# EasyEDA Pro project Thunder F722 Drone Flight Controller_2024-11-16.epro

# Schematic Thunder F722 PCBA Low Cost
Board Name: Board1; Create Date: 2024-11-16; Page Name: SCH_GIT_FULL; Project Name: ⚡ Thunder F722 Drone Flight Controller ⚡; Schematic Name: Thunder F722 PCBA Low Cost; Update Date: 2024-11-16; Add into BOM: yes; Company: TROPICAL FPV; Convert to PCB: yes; Date: 2024-11-15; Draw By: ALESSANDRO; REV: 1.2; Sheet: 1/1
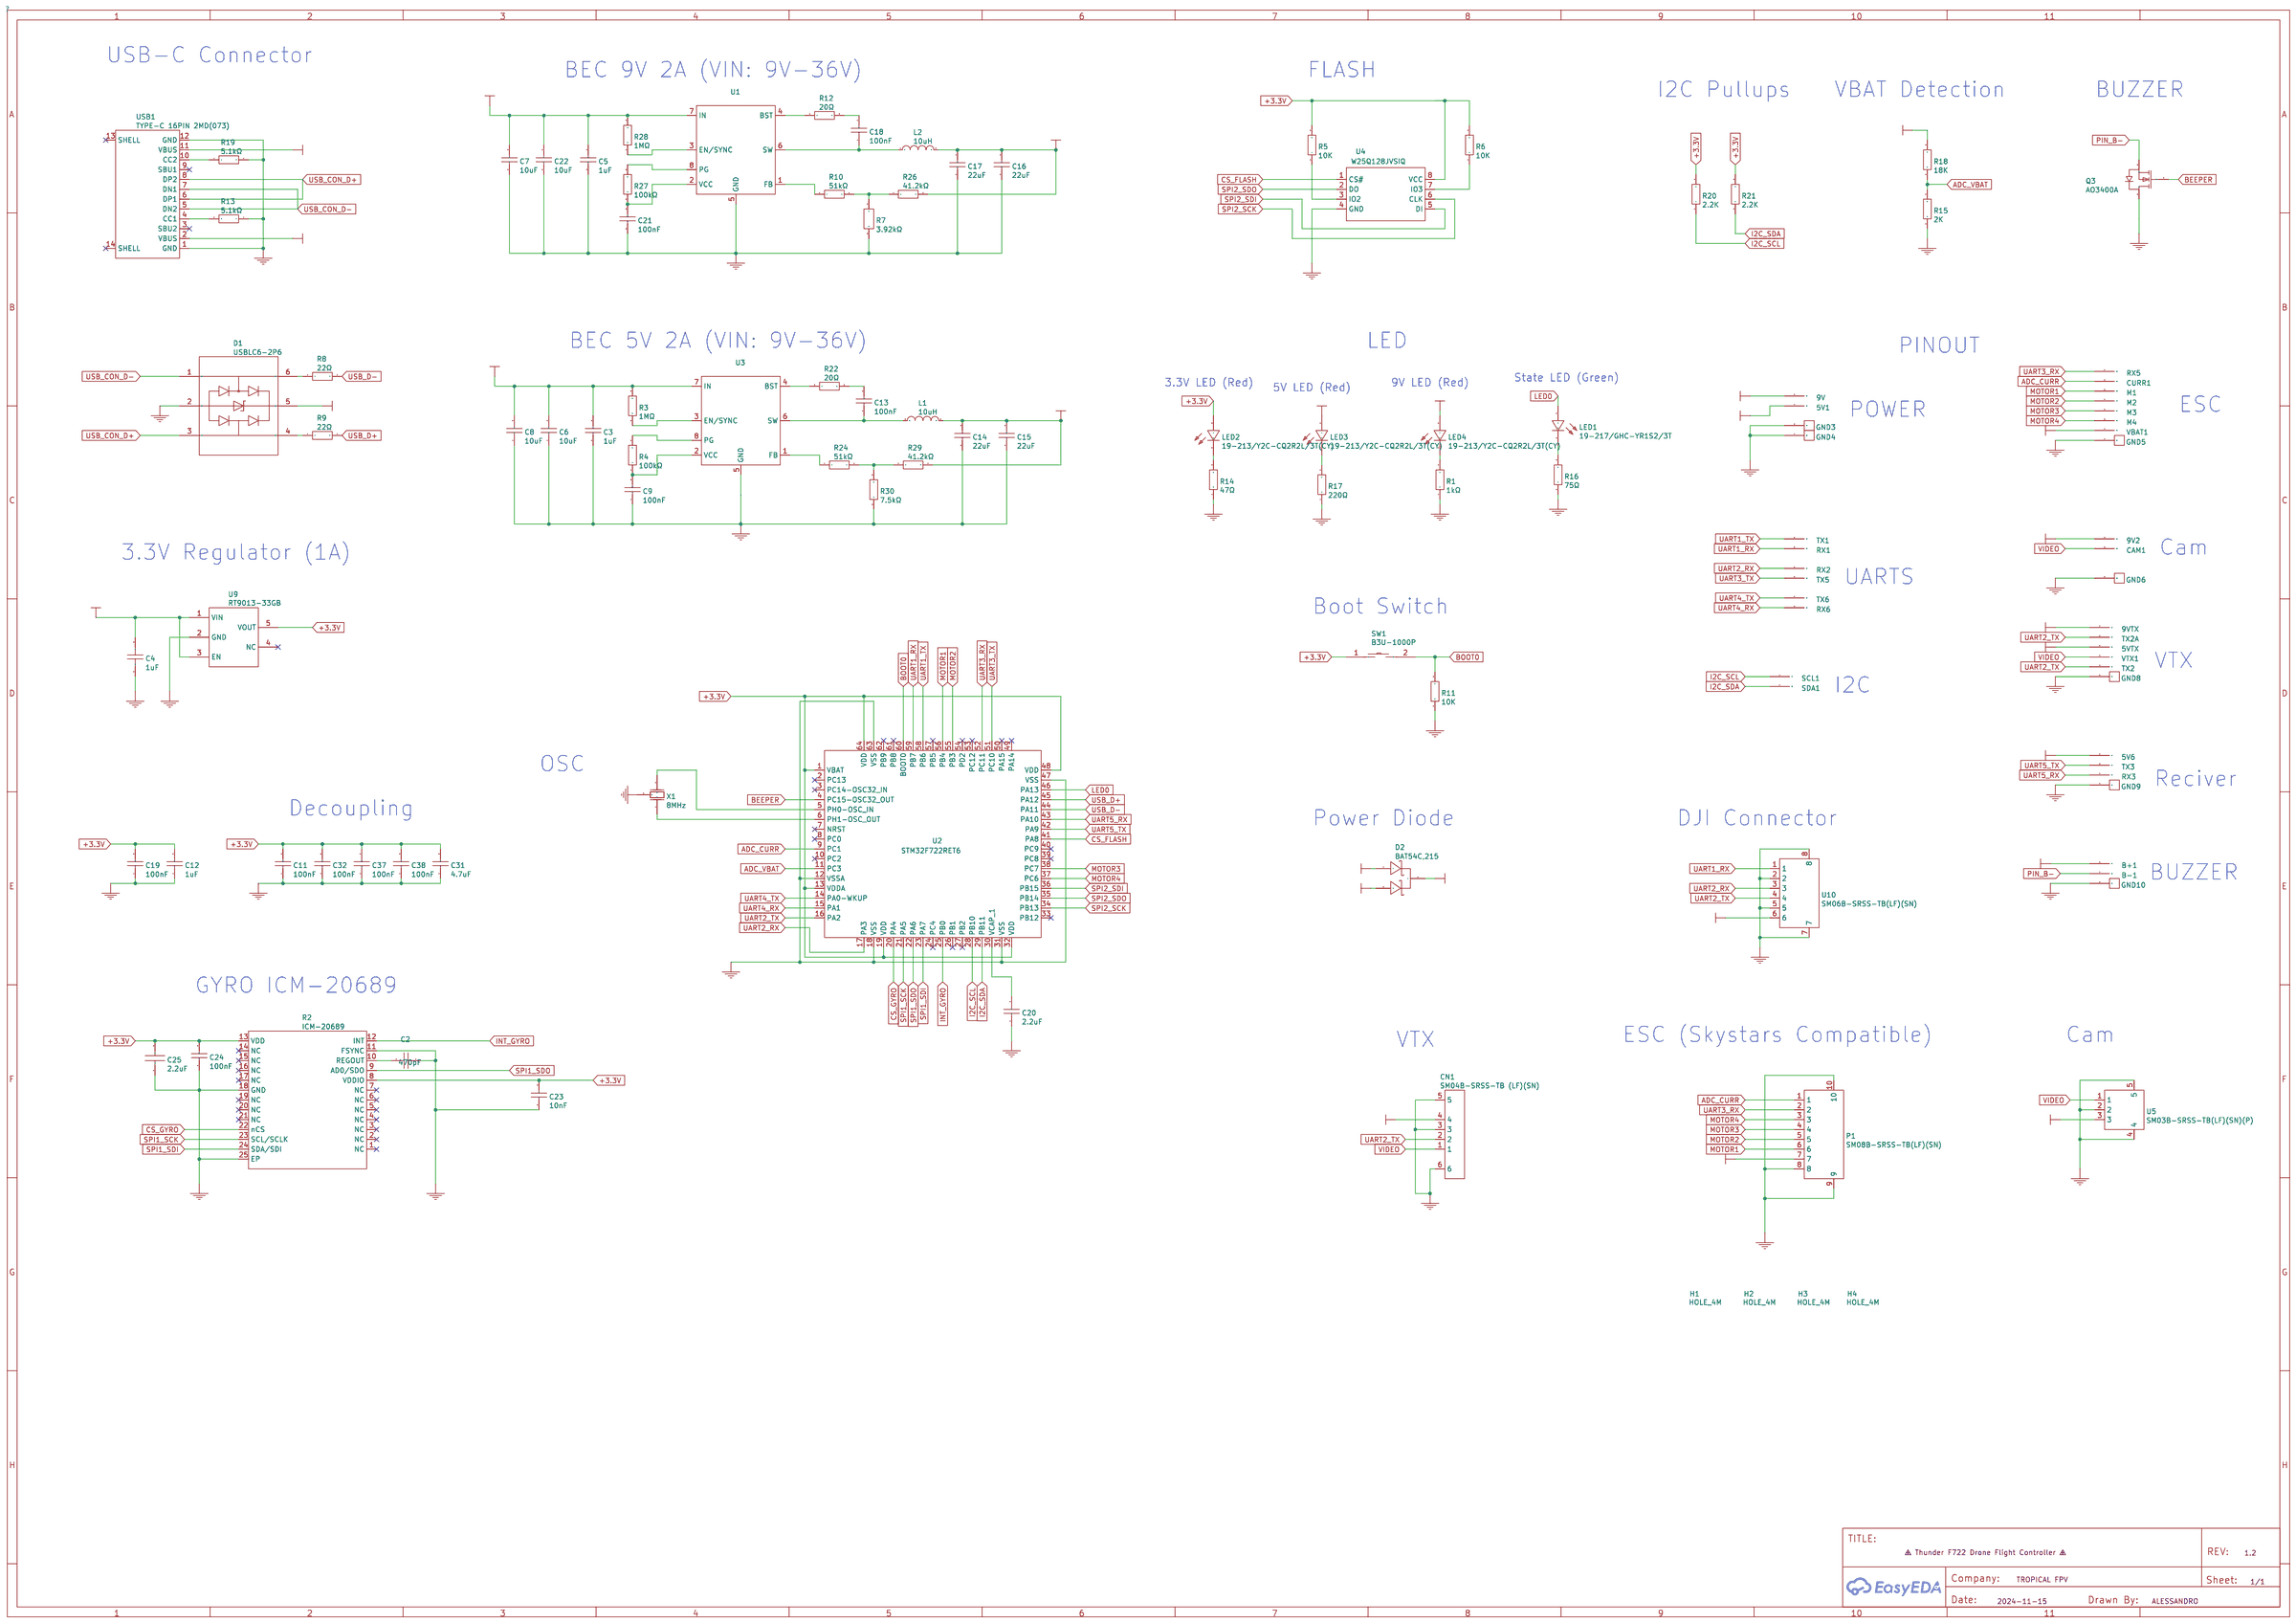
[diagram p0: schematic sheet]

## Parts
5V1  ROUND SOLDER PADS WITH HOLE 1.5MM X 2.5MM COPY  [ROUND SOLDER PADS WITH HOLE 1MM X 1.75MM]  (no BOM)
5V6  ROUND SOLDER PADS WITH HOLE 1.5MM X 2.5MM COPY  [ROUND SOLDER PADS WITH HOLE 1MM X 1.75MM]  (no BOM)
5VTX  ROUND SOLDER PADS WITH HOLE 1.5MM X 2.5MM COPY  [ROUND SOLDER PADS WITH HOLE 1MM X 1.75MM]  (no BOM)
9V  ROUND SOLDER PADS WITH HOLE 1.5MM X 2.5MM COPY  [ROUND SOLDER PADS WITH HOLE 1MM X 1.75MM]  (no BOM)
9V2  ROUND SOLDER PADS WITH HOLE 1.5MM X 2.5MM COPY  [ROUND SOLDER PADS WITH HOLE 1MM X 1.75MM]  (no BOM)
9VTX  ROUND SOLDER PADS WITH HOLE 1.5MM X 2.5MM COPY  [ROUND SOLDER PADS WITH HOLE 1MM X 1.75MM]  (no BOM)
B+1  ROUND SOLDER PADS WITH HOLE 1.5MM X 2.5MM COPY  [ROUND SOLDER PADS WITH HOLE 1MM X 1.75MM]  (no BOM)
B-1  ROUND SOLDER PADS WITH HOLE 1.5MM X 2.5MM COPY  [ROUND SOLDER PADS WITH HOLE 1MM X 1.75MM]  (no BOM)
C2  470pF  [C0402]
C3  1uF  [C0603]
C4  1uF  [C0402]
C5  1uF  [C0603]
C6  10uF  [C1206]
C7  10uF  [C1206]
C8  10uF  [C1206]
C9  100nF  [C0402]
C11  100nF  [C0402]
C12  1uF  [C0603]
C13  100nF  [C0402]
C14  22uF  [C1206]
C15  22uF  [C1206]
C16  22uF  [C1206]
C17  22uF  [C1206]
C18  100nF  [C0402]
C19  100nF  [C0402]
C20  2.2uF  [C0603]
C21  100nF  [C0402]
C22  10uF  [C1206]
C23  10nF  [C0402]
C24  100nF  [C0402]
C25  2.2uF  [C0402]
C31  4.7uF  [C0603]
C32  100nF  [C0402]
C37  100nF  [C0402]
C38  100nF  [C0402]
CAM1  ROUND SOLDER PADS WITH HOLE 1.5MM X 2.5MM COPY  [ROUND SOLDER PADS WITH HOLE 1MM X 1.75MM]  (no BOM)
CN1  SM04B-SRSS-TB (LF)(SN)  [CONN-SMD_4P-P1.00_SM04B-SRSS-TB-LF-SN]
CURR1  ROUND SOLDER PADS WITH HOLE 1.5MM X 2.5MM COPY  [ROUND SOLDER PADS WITH HOLE 1MM X 1.75MM]  (no BOM)
D1  USBLC6-2P6  [SOT-666-6_L1.6-W1.2-P0.50-LS1.6-BR]
D2  BAT54C,215  [SOT-23-3_L2.9-W1.6-P1.90-LS2.8-BR]
GND3  RECTANGLE SOLDER PADS WITH HOLE 1.5MM X 2.5MM  [RECTANGLE SOLDER PADS WITH HOLE 1.25MM X 1.75MM]  (no BOM)
GND4  RECTANGLE SOLDER PADS WITH HOLE 1.5MM X 2.5MM  [RECTANGLE SOLDER PADS WITH HOLE 1.25MM X 1.75MM]  (no BOM)
GND5  RECTANGLE SOLDER PADS WITH HOLE 1.5MM X 2.5MM  [RECTANGLE SOLDER PADS WITH HOLE 1.25MM X 1.75MM]  (no BOM)
GND6  RECTANGLE SOLDER PADS WITH HOLE 1.5MM X 2.5MM  [RECTANGLE SOLDER PADS WITH HOLE 1.25MM X 1.75MM]  (no BOM)
GND8  RECTANGLE SOLDER PADS WITH HOLE 1.5MM X 2.5MM  [RECTANGLE SOLDER PADS WITH HOLE 1.25MM X 1.75MM]  (no BOM)
GND9  RECTANGLE SOLDER PADS WITH HOLE 1.5MM X 2.5MM  [RECTANGLE SOLDER PADS WITH HOLE 1.25MM X 1.75MM]  (no BOM)
GND10  RECTANGLE SOLDER PADS WITH HOLE 1.5MM X 2.5MM  [RECTANGLE SOLDER PADS WITH HOLE 1.25MM X 1.75MM]  (no BOM)
H1  HOLE_4M  [HOLE_4MM]  (no BOM)
H2  HOLE_4M  [HOLE_4MM]  (no BOM)
H3  HOLE_4M  [HOLE_4MM]  (no BOM)
H4  HOLE_4M  [HOLE_4MM]  (no BOM)
L1  10uH  [IND-SMD_L4.4-W4.2_PSPMAA0412]
L2  10uH  [IND-SMD_L4.4-W4.2_PSPMAA0412]
LED1  19-217/GHC-YR1S2/3T  [LED0603-R-RD]
LED2  19-213/Y2C-CQ2R2L/3T(CY)  [LED0603-RD-YELLOW]
LED3  19-213/Y2C-CQ2R2L/3T(CY)  [LED0603-RD-YELLOW]
LED4  19-213/Y2C-CQ2R2L/3T(CY)  [LED0603-RD-YELLOW]
M1  ROUND SOLDER PADS WITH HOLE 1.5MM X 2.5MM COPY  [ROUND SOLDER PADS WITH HOLE 1MM X 1.75MM]  (no BOM)
M2  ROUND SOLDER PADS WITH HOLE 1.5MM X 2.5MM COPY  [ROUND SOLDER PADS WITH HOLE 1MM X 1.75MM]  (no BOM)
M3  ROUND SOLDER PADS WITH HOLE 1.5MM X 2.5MM COPY  [ROUND SOLDER PADS WITH HOLE 1MM X 1.75MM]  (no BOM)
M4  ROUND SOLDER PADS WITH HOLE 1.5MM X 2.5MM COPY  [ROUND SOLDER PADS WITH HOLE 1MM X 1.75MM]  (no BOM)
P1  SM08B-SRSS-TB(LF)(SN)  [CONN-TH_SM08B-SRSS-TB-LF-SN]
Q3  AO3400A  [SOT-23-3_L2.9-W1.6-P1.90-LS2.8-BR]
R1  1kΩ  [R0603]
R2  ICM-20689  [QFN-24_L4.0-W4.0-P0.50-TL-EP2.6]
R3  1MΩ  [R0603]
R4  100kΩ  [R0402]
R5  10K  [R0402]
R6  10K  [R0402]
R7  3.92kΩ  [R1206]
R8  22Ω  [R0402]
R9  22Ω  [R0402]
R10  51kΩ  [R0402]
R11  10K  [R0402]
R12  20Ω  [R0603]
R13  5.1kΩ  [R0402]
R14  47Ω  [R0402]
R15  2K  [R0402]
R16  75Ω  [R0603]
R17  220Ω  [R0402]
R18  18K  [R0402]
R19  5.1kΩ  [R0402]
R20  2.2K  [R0402]
R21  2.2K  [R0402]
R22  20Ω  [R0603]
R24  51kΩ  [R0402]
R26  41.2kΩ  [R1206]
R27  100kΩ  [R0402]
R28  1MΩ  [R0603]
R29  41.2kΩ  [R1206]
R30  7.5kΩ  [R0402]
RX1  ROUND SOLDER PADS WITH HOLE 1.5MM X 2.5MM COPY  [ROUND SOLDER PADS WITH HOLE 1MM X 1.75MM]  (no BOM)
RX2  ROUND SOLDER PADS WITH HOLE 1.5MM X 2.5MM COPY  [ROUND SOLDER PADS WITH HOLE 1MM X 1.75MM]  (no BOM)
RX3  ROUND SOLDER PADS WITH HOLE 1.5MM X 2.5MM COPY  [ROUND SOLDER PADS WITH HOLE 1MM X 1.75MM]  (no BOM)
RX5  ROUND SOLDER PADS WITH HOLE 1.5MM X 2.5MM COPY  [ROUND SOLDER PADS WITH HOLE 1MM X 1.75MM]  (no BOM)
RX6  ROUND SOLDER PADS WITH HOLE 1.5MM X 2.5MM COPY  [ROUND SOLDER PADS WITH HOLE 1MM X 1.75MM]  (no BOM)
SCL1  ROUND SOLDER PADS WITH HOLE 1.5MM X 2.5MM COPY  [ROUND SOLDER PADS WITH HOLE 1MM X 1.75MM]  (no BOM)
SDA1  ROUND SOLDER PADS WITH HOLE 1.5MM X 2.5MM COPY  [ROUND SOLDER PADS WITH HOLE 1MM X 1.75MM]  (no BOM)
SW1  B3U-1000P  [KEY-SMD_B3U-1000PM]
TX1  ROUND SOLDER PADS WITH HOLE 1.5MM X 2.5MM COPY  [ROUND SOLDER PADS WITH HOLE 1MM X 1.75MM]  (no BOM)
TX2  ROUND SOLDER PADS WITH HOLE 1.5MM X 2.5MM COPY  [ROUND SOLDER PADS WITH HOLE 1MM X 1.75MM]  (no BOM)
TX2A  ROUND SOLDER PADS WITH HOLE 1.5MM X 2.5MM COPY  [ROUND SOLDER PADS WITH HOLE 1MM X 1.75MM]  (no BOM)
TX3  ROUND SOLDER PADS WITH HOLE 1.5MM X 2.5MM COPY  [ROUND SOLDER PADS WITH HOLE 1MM X 1.75MM]  (no BOM)
TX5  ROUND SOLDER PADS WITH HOLE 1.5MM X 2.5MM COPY  [ROUND SOLDER PADS WITH HOLE 1MM X 1.75MM]  (no BOM)
TX6  ROUND SOLDER PADS WITH HOLE 1.5MM X 2.5MM COPY  [ROUND SOLDER PADS WITH HOLE 1MM X 1.75MM]  (no BOM)
U1  NO  [QFN-8_L3.0-W3.0-P0.65-BL]
U2  STM32F722RET6  [LQFP-64_L10.0-W10.0-P0.50-LS12.0-BL]
U3  NO  [QFN-8_L3.0-W3.0-P0.65-BL]
U4  W25Q128JVSIQ  [SOIC-8_L5.3-W5.3-P1.27-LS8.0-BL]
U5  SM03B-SRSS-TB(LF)(SN)(P)  [CONN-SMD_SM03B-SRSS-TB-LF-SN-P]
U9  RT9013-33GB  [SOT-23-5_L3.0-W1.7-P0.95-LS2.8-BR]
U10  SM06B-SRSS-TB(LF)(SN)  [CONN-SMD_SM06B-SRSS-TB(LF)(SN)]
USB1  TYPE-C 16PIN 2MD(073)  [USB-C-SMD_TYPE-C-6PIN-2MD-073]
VBAT1  ROUND SOLDER PADS WITH HOLE 1.5MM X 2.5MM COPY  [ROUND SOLDER PADS WITH HOLE 1MM X 1.75MM]  (no BOM)
VTX1  ROUND SOLDER PADS WITH HOLE 1.5MM X 2.5MM COPY  [ROUND SOLDER PADS WITH HOLE 1MM X 1.75MM]  (no BOM)
X1  8MHz  [OSC-SMD_3P-L3.2-W1.3-P1.20-L]

## Library data of the parts
5V1 5V6 5VTX 9V 9V2 9VTX B+1 B-1 CAM1 CURR1 M1-M4 RX1-RX3 RX5 RX6 SCL1 SDA1 TX1 TX2 TX2A TX3 TX5 TX6 VBAT1 VTX1 = ROUND SOLDER PADS WITH HOLE 1.5MM X 2.5MM COPY: Manufacturer Part: solderpad
C2 = 470pF: Supplier: LCSC; Manufacturer: FH(风华); Manufacturer Part: 0402B471K500NT; Supplier Part: C1537; JLCPCB Part Class: Basic Part; link: https://lcsc.com/eda_search?q=C1537&amp;%26type=1&amp;ref=editor
C3 C5 C12 = 1uF: Supplier: LCSC; Manufacturer Part: CL10A105KB8NNNC; Manufacturer: SAMSUNG; Supplier Part: C15849; JLCPCB Part Class: Basic
C4 = 1uF: Supplier: LCSC; Manufacturer: SAMSUNG; Manufacturer Part: CL05A105KA5NQNC; Supplier Part: C52923; JLCPCB Part Class: Basic
C6-C8 C22 = 10uF: Supplier: LCSC; Manufacturer Part: CL31A106KBHNNNE; Manufacturer: SAMSUNG; Supplier Part: C13585; JLCPCB Part Class: Basic
C9 C11 C13 C18 C19 C21 C24 C32 C37 C38 = 100nF: Supplier: LCSC; Manufacturer Part: CL05B104KO5NNNC; Manufacturer: SAMSUNG; Supplier Part: C1525; JLCPCB Part Class: Basic
C14-C17 = 22uF: Supplier: LCSC; Manufacturer Part: CL31A226KPHNNNE; Manufacturer: SAMSUNG(三星); Supplier Part: C5672; JLCPCB Part Class: Basic Part; link: https://lcsc.com/eda_search?q=C5672&amp;%26type=1&amp;ref=editor
C20 = 2.2uF: Supplier: LCSC; Manufacturer Part: CL10A225KO8NNNC; Manufacturer: SAMSUNG; Supplier Part: C23630; JLCPCB Part Class: Basic
C23 = 10nF: Supplier: LCSC; Manufacturer Part: CL05B103KB5NNNC; Manufacturer: SAMSUNG(三星); Supplier Part: C15195; JLCPCB Part Class: Basic Part; link: https://lcsc.com/eda_search?q=C15195&amp;%26type=1&amp;ref=editor
C25 = 2.2uF: Supplier: LCSC; Manufacturer Part: CL05A225MQ5NSNC; Manufacturer: SAMSUNG(三星); Supplier Part: C12530; JLCPCB Part Class: Basic Part; link: https://lcsc.com/eda_search?q=C12530&amp;%26type=1&amp;ref=editor
C31 = 4.7uF: Supplier: LCSC; Manufacturer Part: CL10A475KO8NNNC; Manufacturer: SAMSUNG; Supplier Part: C19666; JLCPCB Part Class: Basic
CN1 = SM04B-SRSS-TB (LF)(SN): Supplier: LCSC; Supplier Part: C160404; Manufacturer: JST; Manufacturer Part: SM04B-SRSS-TB(LF)(SN); JLCPCB Part Class: Extended Part; link: https://lcsc.com/eda_search?q=C160404&amp;%26type=1&amp;ref=editor
D1 = USBLC6-2P6: Supplier: LCSC; Manufacturer: STMicroelectronics; image: //image.lceda.cn/szlcsc/C15999.jpg; Supplier Part: C15999; JLCPCB Part Class: Extend
D2 = BAT54C,215: Supplier: LCSC; Manufacturer: Nexperia(安世); Supplier Part: C37704; JLCPCB Part Class: Basic Part; link: https://lcsc.com/eda_search?q=C37704&amp;%26type=1&amp;ref=editor
GND3-GND6 GND8-GND10 = RECTANGLE SOLDER PADS WITH HOLE 1.5MM X 2.5MM: Manufacturer Part: solderpad
H1-H4 = HOLE_4M
L1 L2 = 10uH: Supplier: LCSC; Supplier Part: C351093; Manufacturer: YJYCOIN(益嘉源); Manufacturer Part: YSPI0420-100M; JLCPCB Part Class: Extended Part; link: https://lcsc.com/eda_search?q=C351093&amp;%26type=1&amp;ref=editor
LED1 = 19-217/GHC-YR1S2/3T: Supplier: LCSC; Manufacturer: EVERLIGHT; image: //image.lceda.cn/szlcsc/C72043.jpg; Supplier Part: C72043; JLCPCB Part Class: Basic
LED2-LED4 = 19-213/Y2C-CQ2R2L/3T(CY): Supplier: LCSC; Manufacturer: EVERLIGHT(亿光); Supplier Part: C72038; JLCPCB Part Class: Basic Part
P1 = SM08B-SRSS-TB(LF)(SN): Supplier: LCSC; Supplier Part: C160407; Manufacturer: JST; JLCPCB Part Class: Extended Part; link: https://lcsc.com/eda_search?q=C160407&amp;%26type=1&amp;ref=editor
Q3 = AO3400A: Supplier: LCSC; Manufacturer: AOS; image: //image.lceda.cn/szlcsc/C20917.jpg; Supplier Part: C20917; JLCPCB Part Class: Basic
R1 = 1kΩ: Supplier: LCSC; Manufacturer: UNI-ROYAL(厚声); Manufacturer Part: 0603WAF1001T5E; Supplier Part: C21190; JLCPCB Part Class: Basic Part
R2 = ICM-20689: Supplier: LCSC; Supplier Part: C2649494; Manufacturer: TDK InvenSense(应美盛); JLCPCB Part Class: Extended Part; link: https://lcsc.com/eda_search?q=C2649494&amp;%26type=1&amp;ref=editor
R3 R28 = 1MΩ: Supplier: LCSC; Manufacturer: UNI-ROYAL(厚声); Manufacturer Part: 0603WAF1004T5E; Supplier Part: C22935; JLCPCB Part Class: Basic Part; link: https://lcsc.com/eda_search?q=C22935&amp;%26type=1&amp;ref=editor
R4 R27 = 100kΩ: Supplier: LCSC; Manufacturer: UNI-ROYAL(厚声); Manufacturer Part: 0402WGF1003TCE; Supplier Part: C25741; JLCPCB Part Class: Basic Part; link: https://lcsc.com/eda_search?q=C25741&amp;%26type=1&amp;ref=editor
R5 R6 R11 = 10K: Supplier: LCSC; Manufacturer: UniOhm; Manufacturer Part: 0402WGF1002TCE; Supplier Part: C25744; JLCPCB Part Class: Basic
R7 = 3.92kΩ: Supplier: LCSC; Supplier Part: C407270; Manufacturer: UNI-ROYAL(厚声); Manufacturer Part: 1206W4F3921T5E; JLCPCB Part Class: Extended Part
R8 R9 = 22Ω: Supplier: LCSC; Manufacturer: UNI-ROYAL(厚声); Manufacturer Part: 0402WGF220JTCE; Supplier Part: C25092; JLCPCB Part Class: Basic Part; link: https://lcsc.com/eda_search?q=C25092&amp;%26type=1&amp;ref=editor
R10 R24 = 51kΩ: Supplier: LCSC; Manufacturer: UNI-ROYAL(厚声); Manufacturer Part: 0402WGF5102TCE; Supplier Part: C25794; JLCPCB Part Class: Basic Part; link: https://lcsc.com/eda_search?q=C25794&amp;%26type=1&amp;ref=editor
R12 R22 = 20Ω: Supplier: LCSC; Manufacturer: UNI-ROYAL(厚声); Manufacturer Part: 0603WAF200JT5E; Supplier Part: C22950; JLCPCB Part Class: Basic Part; link: https://lcsc.com/eda_search?q=C22950&amp;%26type=1&amp;ref=editor
R13 R19 = 5.1kΩ: Supplier: LCSC; Manufacturer: UNI-ROYAL(厚声); Manufacturer Part: 0402WGF5101TCE; Supplier Part: C25905; JLCPCB Part Class: Basic Part; link: https://lcsc.com/eda_search?q=C25905&amp;%26type=1&amp;ref=editor
R14 = 47Ω: Supplier: LCSC; Manufacturer: UniOhm; Manufacturer Part: 0402WGF470JTCE; Supplier Part: C25118; JLCPCB Part Class: Basic
R15 = 2K: Supplier: LCSC; Manufacturer Part: 0402WGF2001TCE; Manufacturer: UniOhm; Supplier Part: C4109; JLCPCB Part Class: Basic
R16 = 75Ω: Supplier: LCSC; Manufacturer: UniOhm; Manufacturer Part: 0603WAF750JT5E; Supplier Part: C4275; JLCPCB Part Class: Basic
R17 = 220Ω: Supplier: LCSC; Manufacturer: UniOhm; Manufacturer Part: 0402WGF2200TCE; Supplier Part: C25091; JLCPCB Part Class: Basic
R18 = 18K: Supplier: LCSC; Manufacturer: UniOhm; Manufacturer Part: 0402WGF1802TCE; Supplier Part: C25762; JLCPCB Part Class: Basic
R20 R21 = 2.2K: Supplier: LCSC; Manufacturer: UniOhm; Manufacturer Part: 0402WGF2201TCE; Supplier Part: C25879; JLCPCB Part Class: Basic
R26 R29 = 41.2kΩ: Supplier: LCSC; Supplier Part: C323042; Manufacturer: FH(风华); Manufacturer Part: RS-06K4122FT; JLCPCB Part Class: Extended Part
R30 = 7.5kΩ: Supplier: LCSC; Manufacturer: UNI-ROYAL(厚声); Manufacturer Part: 0402WGF7501TCE; Supplier Part: C25918; JLCPCB Part Class: Basic Part; link: https://lcsc.com/eda_search?q=C25918&amp;%26type=1&amp;ref=editor
SW1 = B3U-1000P: Supplier: LCSC; Supplier Part: C231329; Manufacturer: OMRON(欧姆龙); JLCPCB Part Class: Extended Part; link: https://lcsc.com/eda_search?q=C231329&amp;%26type=1&amp;ref=editor
U1 U3 = NO: Supplier: LCSC; Supplier Part: C477821; Manufacturer: null; Manufacturer Part: MP9943GQ-Z; JLCPCB Part Class: Extended Part
U2 = STM32F722RET6: Supplier: LCSC; Supplier Part: C118207; Manufacturer: STMicroelectronics; JLCPCB Part Class: Extend
U4 = W25Q128JVSIQ: Supplier: LCSC; Manufacturer: WINBOND; Supplier Part: C97521; JLCPCB Part Class: Basic
U5 = SM03B-SRSS-TB(LF)(SN)(P): Supplier: LCSC; Supplier Part: C160403; Manufacturer: JST; Manufacturer Part: SM03B-SRSS-TB(LF)(SN); JLCPCB Part Class: Extended Part; link: https://lcsc.com/eda_search?q=C160403&amp;%26type=1&amp;ref=editor
U9 = RT9013-33GB: Supplier: LCSC; Manufacturer: RICHTEK; image: //image.lceda.cn/szlcsc/C47773.jpg; Supplier Part: C47773; JLCPCB Part Class: Extend
U10 = SM06B-SRSS-TB(LF)(SN): Supplier: LCSC; Supplier Part: C160405; Manufacturer: JST Sales America
USB1 = TYPE-C 16PIN 2MD(073): Supplier: LCSC; Supplier Part: C2765186; Manufacturer: SHOU HAN(首韩); JLCPCB Part Class: Extended Part; link: https://lcsc.com/eda_search?q=C2765186&amp;%26type=1&amp;ref=editor
X1 = 8MHz: Supplier: LCSC; Supplier Part: C341522; Manufacturer: muRata(村田); Manufacturer Part: CSTNE8M00G550000R0; JLCPCB Part Class: Extended Part; LINK: https://pt.aliexpress.com/item/1005003999625742.html?spm=a2g0o.detail.pcDetailTopMoreOtherSeller.1.7294r6u0r6u0H8&amp;gps-id=pcDetailTopMoreOtherSeller&amp;scm=1007.14452.396806.0&amp;scm_id=1007.14452.396806.0&amp;s

## Nets
+3.3V: C11.2 C12.2 C19.2 C23.2 C24.2 C25.2 C31.2 C32.2 C37.2 C38.2 LED2.2(A) R2.8(VDDIO) R2.13(VDD) R5.2 R6.2 R20.2 R21.2 SW1.1 U2.1(VBAT) U2.13(VDDA) U2.19(VDD) U2.32(VDD) U2.48(VDD) U2.64(VDD) U4.8(VCC) U9.5(VOUT)
+5V: 5V1.1(pad) 5V6.1(pad) 5VTX.1(pad) B+1.1(pad) C4.2 CN1.4 D2.3(K) LED3.2(A) U9.1(VIN) U9.3(EN)
+5VBAT: C14.2 C15.2 D2.1(A) L1.2 R29.2
+5VBUS: D1.5(VBUS) D2.2(A) USB1.2(VBUS) USB1.11(VBUS)
+9V: 9V.1(pad) 9V2.1(pad) 9VTX.1(pad) C16.2 C17.2 L2.2 LED4.2(A) R26.2 U5.3 U10.6
GND: C2.1 C3.1 C4.1 C5.1 C6.1 C7.1 C8.1 C9.1 C11.1 C12.1 C14.1 C15.1 C16.1 C17.1 C19.1 C20.1 C21.1 C22.1 C23.1 C24.1 C25.1 C31.1 C32.1 C37.1 C38.1 CN1.3 CN1.5 CN1.6 D1.2(GND) GND3.1(pad) GND4.1(pad) GND5.1(pad) GND6.1(pad) GND8.1(pad) GND9.1(pad) GND10.1(pad) P1.8 P1.9 P1.10 Q3.3(D) R1.1 R2.11(FSYNC) R2.18(GND) R2.25(EP) R7.2 R11.1 R13.1 R14.1 R15.1 R16.1 R17.1 R19.2 R30.1 U1.5(GND) U2.12(VSSA) U2.18(VSS) U2.31(VSS) U2.47(VSS) U2.63(VSS) U3.5(GND) U4.4(GND) U5.2 U5.4 U5.5 U9.2(GND) U10.2 U10.5 U10.7 U10.8 USB1.1(GND) USB1.12(GND) X1.2(GND)
+VLIPO: C3.2 C5.2 C6.2 C7.2 C8.2 C22.2 P1.7 R3.2 R18.2 R28.2 U1.7(IN) U3.7(IN) VBAT1.1(pad)
ADC_CURR: CURR1.1(pad) P1.1 U2.9(PC1)
ADC_VBAT: R15.2 R18.1 U2.11(PC3)
BEEPER: Q3.1(G) U2.4(PC15-OSC32_OUT)
BOOT0: R11.2 SW1.2 U2.60(BOOT0)
CS_FLASH: U2.41(PA8) U4.1(CS#)
CS_GYRO: R2.22(nCS) U2.20(PA4)
I2C_SCL: R20.1 SCL1.1(pad) U2.28(PB10)
I2C_SDA: R21.1 SDA1.1(pad) U2.29(PB11)
INT_GYRO: R2.12(INT) U2.25(PB0)
LED0: LED1.1(A) U2.46(PA13)
MOTOR1: M1.1(pad) P1.6 U2.56(PB4)
MOTOR2: M2.1(pad) P1.5 U2.55(PB3)
MOTOR3: M3.1(pad) P1.4 U2.38(PC7)
MOTOR4: M4.1(pad) P1.3 U2.37(PC6)
PIN_B-: B-1.1(pad) Q3.2(S)
SPI1_SCK: R2.23(SCL/SCLK) U2.21(PA5)
SPI1_SDI: R2.24(SDA/SDI) U2.23(PA7)
SPI1_SDO: R2.9(AD0/SDO) U2.22(PA6)
SPI2_SCK: U2.34(PB13) U4.6(CLK)
SPI2_SDI: U2.36(PB15) U4.5(DI)
SPI2_SDO: U2.35(PB14) U4.2(DO)
UART1_RX: RX1.1(pad) U2.59(PB7) U10.1
UART1_TX: TX1.1(pad) U2.58(PB6)
UART2_RX: RX2.1(pad) U2.17(PA3) U10.3
UART2_TX: CN1.2 TX2.1(pad) TX2A.1(pad) U2.16(PA2) U10.4
UART3_RX: P1.2 RX5.1(pad) U2.52(PC11)
UART3_TX: TX5.1(pad) U2.51(PC10)
UART4_RX: RX6.1(pad) U2.15(PA1)
UART4_TX: TX6.1(pad) U2.14(PA0-WKUP)
UART5_RX: RX3.1(pad) U2.43(PA10)
UART5_TX: TX3.1(pad) U2.42(PA9)
USB_CON_D+: D1.3(I/O2) USB1.6(DP1) USB1.8(DP2)
USB_CON_D-: D1.1(I/O1) USB1.5(DN2) USB1.7(DN1)
USB_D+: R9.2 U2.45(PA12)
USB_D-: R8.2 U2.44(PA11)
VIDEO: CAM1.1(pad) CN1.1 U5.1 VTX1.1(pad)
$1N9: R5.1 U4.3(IO2)
$1N10: R6.1 U4.7(IO3)
$1N26: LED4.1(C) R1.2
$1N27: LED3.1(C) R17.2
$1N39: LED1.2(C) R16.2
$1N43: LED2.1(C) R14.2
$1N92: U2.6(PH1-OSC_OUT) X1.1(OSC1)
$1N93: U2.5(PH0-OSC_IN) X1.3(OSC2)
$1N96: C20.2 U2.30(VCAP_1)
$1N110: D1.6(I/O1) R8.1
$1N111: D1.4(I/O2) R9.1
$1N118: C2.2 R2.10(REGOUT)
$1N127: R19.1 USB1.10(CC2)
$1N128: R13.2 USB1.4(CC1)
$1N143: R3.1 U3.3(EN/SYNC)
$1N144: R4.2 U3.8(PG)
$1N145: C9.2 R4.1 U3.2(VCC)
$1N146: R22.1 U3.4(BST)
$1N147: C13.2 R22.2
$1N148: C13.1 L1.1 U3.6(SW)
$1N151: R24.2 R29.1 R30.2
$1N153: R24.1 U3.1(FB)
$1N154: R10.1 U1.1(FB)
$1N156: R7.1 R10.2 R26.1
$1N158: C18.1 L2.1 U1.6(SW)
$1N159: C18.2 R12.2
$1N160: R12.1 U1.4(BST)
$1N162: C21.2 R27.1 U1.2(VCC)
$1N163: R27.2 U1.8(PG)
$1N164: R28.1 U1.3(EN/SYNC)

Not connected (* = marked no-connect by the designer): R2 1(NC)* 2(NC)* 3(NC)* 4(NC)* 5(NC)* 6(NC)* 7(NC)* 14(NC)* 15(NC)* 16(NC)* 17(NC)* 19(NC)* 20(NC)* 21(NC)*; U2 2(PC13)* 3(PC14-OSC32_IN)* 7(NRST)* 8(PC0)* 10(PC2)* 24(PC4)* 26(PB1)* 27(PB2)* 33(PB12)* 39(PC8)* 40(PC9)* 49(PA14)* 50(PA15)* 53(PC12)* 54(PD2)* 57(PB5)* 61(PB8)* 62(PB9)*; U9 4(NC)*; USB1 3(SBU2)* 9(SBU1)* 13(SHELL)* 14(SHELL)*

## Notes on the sheet
- USB-C Connector
- BEC 9V 2A (VIN: 9V-36V)
- FLASH
- I2C Pullups
- VBAT Detection
- BUZZER
- BEC 5V 2A (VIN: 9V-36V)
- LED
- PINOUT
- 3.3V LED (Red)
- 9V LED (Red)
- State LED (Green)
- 5V LED (Red)
- POWER
- ESC
- 3.3V Regulator (1A)
- Cam
- UARTS
- Boot Switch
- VTX
- I2C
- OSC
- Reciver
- Decoupling
- Power Diode
- DJI Connector
- BUZZER
- GYRO ICM-20689
- VTX
- ESC (Skystars Compatible)
- Cam

# Board Thunder_REVC_PCB
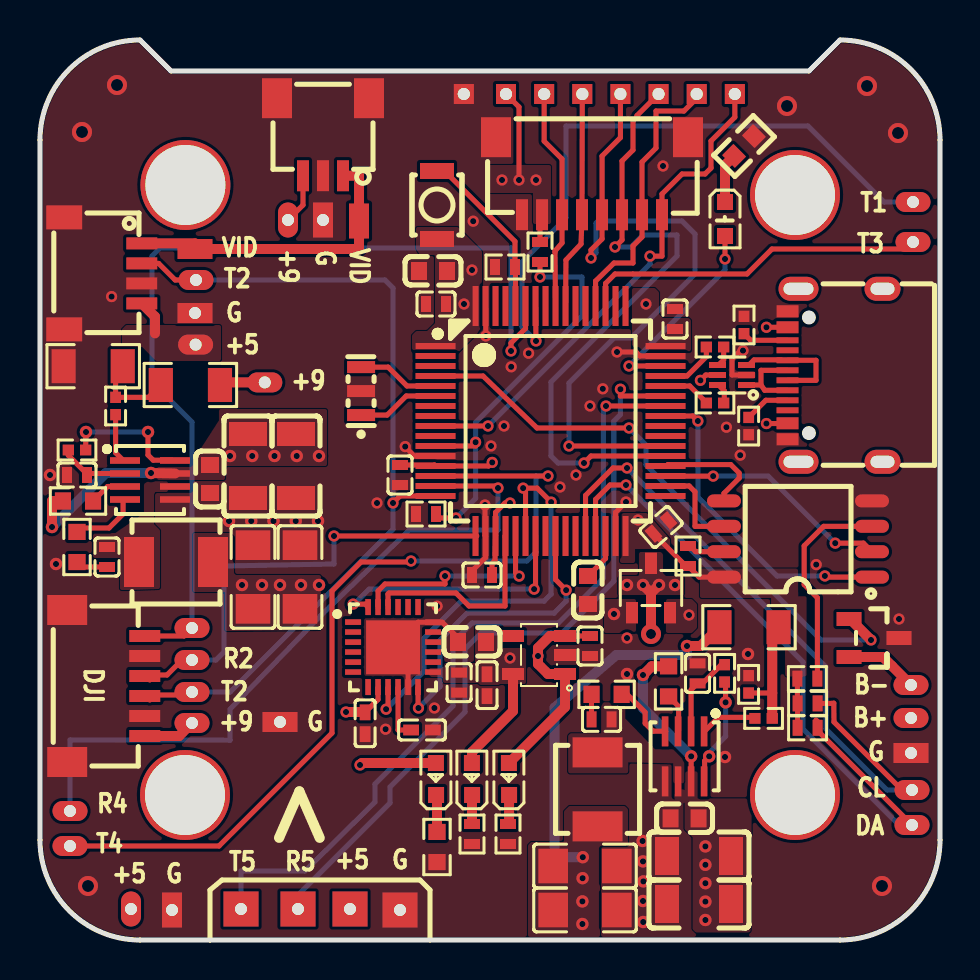
[diagram p1: board, top side]
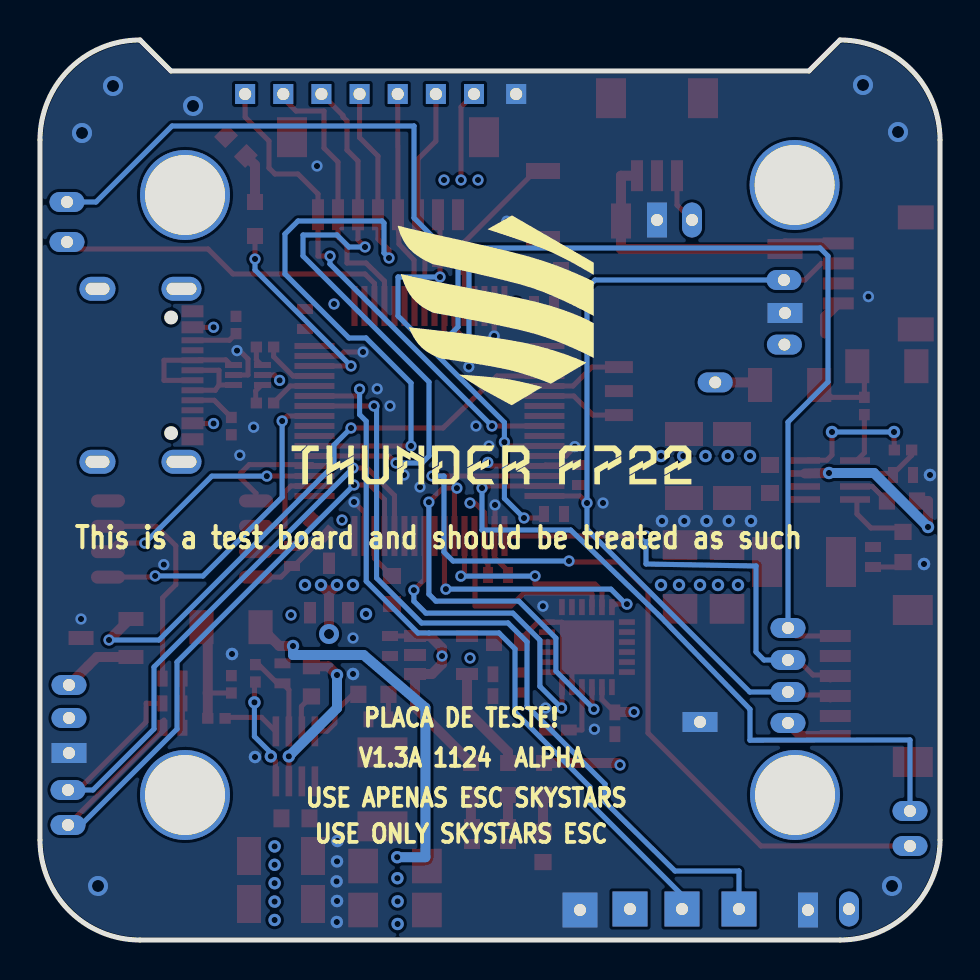
[diagram p2: board, bottom side, seen from below]

Outline 45 x 45 mm; copper layers: Top Layer, GND, PWR1, PWR2, GND, Bottom Layer. Coordinates in mm from the lower left corner of the outline.
Outline path: 0,40 arc(1.46,43.54) 5,45 6.55,43.45 38.45,43.45 40,45 arc(43.54,43.54) 45,40 45,5 arc(43.54,1.46) 40,0 5,0 arc(1.46,1.46) 0,5 0,40
Stack: Top Layer 0.035mm / Dielectric1 0.274mm PP er 4.5 / GND 0.035mm / Dielectric2 0.274mm PP er 4.5 / PWR1 0.035mm / Dielectric3 0.274mm FR4 er 4.5 / PWR2 0.035mm / Dielectric4 0.274mm PP er 4.5 / GND 0.035mm / Dielectric5 0.274mm PP er 4.5 / Bottom Layer 0.035mm

## Design rules (mm)
spacing Default (default): track to track 0.152, other pairs 0 to 0.152
track width Default (default): min 0.254, default 0.254, max 25.4
differential pair differentialPair (default): width min 0.127, default 0.254, max 2.54; gap min 0.152, default 0.152
via Default (default): diameter min 0.55, default 0.55, max 100.025; hole min 0.305, default 0.305, max 59.995
pour e134 uses gge28288
pour e150 uses gge28294
pour e152 uses gge27499
pour e154 uses gge27526
pour e156 uses gge28288(1)
pour e158 uses gge15003
pour e160 uses gge17247
pour e162 uses gge17430
pour e164 uses gge27130
pour e166 uses gge27184
pour e169 uses gge27493
pour e171 uses gge28264
pour e177 uses gge27745
pour e538 uses gge31503
pour e540 uses gge14805
pour e542 uses gge17019
pour e544 uses gge17238
pour e546 uses gge17283
pour e548 uses gge17295
pour e550 uses gge17538
pour e552 uses gge25872
pour e554 uses gge25851
pour e556 uses gge22661
pour e558 uses gge23484
pour e560 uses gge23748
pour e562 uses gge23760
pour e564 uses gge23772
pour e566 uses gge24553
pour e568 uses gge27412
pour e570 uses gge27745(1)

## Placement (name value [footprint] x y rotation side)
5V1  ROUND SOLDER PADS WITH HOLE 1.5MM X 2.5MM COPY  [ROUND SOLDER PADS WITH HOLE 1MM X 1.75MM]  4.55 1.55 0 top
5V6  ROUND SOLDER PADS WITH HOLE 1.5MM X 2.5MM COPY  [ROUND SOLDER PADS WITH HOLE 1MM X 1.75MM#2]  15.5 1.55 0 top
5VTX  ROUND SOLDER PADS WITH HOLE 1.5MM X 2.5MM COPY  [ROUND SOLDER PADS WITH HOLE 1MM X 1.75MM]  7.78 29.77 90 top
9V  ROUND SOLDER PADS WITH HOLE 1.5MM X 2.5MM COPY  [ROUND SOLDER PADS WITH HOLE 1MM X 1.75MM]  7.6 10.85 270 top
9V2  ROUND SOLDER PADS WITH HOLE 1.5MM X 2.5MM COPY  [ROUND SOLDER PADS WITH HOLE 1MM X 1.75MM]  12.4 36 180 top
9VTX  ROUND SOLDER PADS WITH HOLE 1.5MM X 2.5MM COPY  [ROUND SOLDER PADS WITH HOLE 1MM X 1.75MM]  11.24 27.88 270 top
B+1  ROUND SOLDER PADS WITH HOLE 1.5MM X 2.5MM COPY  [ROUND SOLDER PADS WITH HOLE 1MM X 1.75MM]  43.55 11.1 90 top
B-1  ROUND SOLDER PADS WITH HOLE 1.5MM X 2.5MM COPY  [ROUND SOLDER PADS WITH HOLE 1MM X 1.75MM]  43.55 12.75 90 top
C2  470pF  [C0402#2]  19.1 10.5 180 top
C3  1uF  [C0603]  32.23 6.08 0 top
C4  1uF  [C0402]  27.5 14.7 90 top
C5  1uF  [C0603]  8.5 23.05 90 top
C6  10uF  [C1206]  32.95 4.2 0 top
C7  10uF  [C1206]  10.4 23.7 90 top
C8  10uF  [C1206]  32.95 1.8 0 top
C9  100nF  [C0402]  32.88 13.33 270 top
C11  100nF  [C0402]  19.8 31.8 0 top
C12  1uF  [C0603]  21.6 14.9 0 top
C13  100nF  [C0402]  28.08 11.03 180 top
C14  22uF  [C1206#2]  27.25 3.7 180 top
C15  22uF  [C1206#2]  27.25 1.5 180 top
C16  22uF  [C1206#2]  10.65 18.15 270 top
C17  22uF  [C1206#2]  13 18.15 270 top
C18  100nF  [C0402]  3.35 19.15 270 top
C19  100nF  [C0402]  22.1 18.25 0 top
C20  2.2uF  [C0603]  27.4 17.5 90 top
C21  100nF  [C0402]  1.85 23.25 0 top
C22  10uF  [C1206]  12.8 23.7 90 top
C23  10nF  [C0402#2]  16.26 10.84 90 top
C24  100nF  [C0402]  20.96 12.87 90 top
C25  2.2uF  [C0402#2]  22.35 12.74 90 top
C31  4.7uF  [C0603]  19.65 33.45 0 top
C32  100nF  [C0402]  18 23.25 90 top
C37  100nF  [C0402]  31.05 20.65 221 top
C38  100nF  [C0402]  31.75 31.05 270 top
CAM1  ROUND SOLDER PADS WITH HOLE 1.5MM X 2.5MM COPY  [ROUND SOLDER PADS WITH HOLE 1MM X 1.75MM#3]  15.95 35.95 0 top
CN1  SM04B-SRSS-TB (LF)(SN)  [CONN-SMD_4P-P1.00_SM04B-SRSS-TB-LF-SN]  3.15 33.33 270 top
CURR1  ROUND SOLDER PADS WITH HOLE 1.5MM X 2.5MM COPY  [ROUND SOLDER PADS WITH HOLE 1MM X 1.75MM#4]  34.74 42.3 0 top
D1  USBLC6-2P6  [SOT-666-6_L1.6-W1.2-P0.50-LS1.6-BR]  34.6 28.25 0 top
D2  BAT54C,215  [SOT-23-3_L2.9-W1.6-P1.90-LS2.8-BR]  30.55 17.6 270 top
GND3  RECTANGLE SOLDER PADS WITH HOLE 1.5MM X 2.5MM  [RECTANGLE SOLDER PADS WITH HOLE 1.25MM X 1.75MM#2]  6.6 1.5 0 top
GND4  RECTANGLE SOLDER PADS WITH HOLE 1.5MM X 2.5MM  [RECTANGLE SOLDER PADS WITH HOLE 1.25MM X 1.75MM#2]  14.15 36 0 top
GND5  RECTANGLE SOLDER PADS WITH HOLE 1.5MM X 2.5MM  [RECTANGLE SOLDER PADS WITH HOLE 1.25MM X 1.75MM]  21.19 42.3 0 top
GND6  RECTANGLE SOLDER PADS WITH HOLE 1.5MM X 2.5MM  [RECTANGLE SOLDER PADS WITH HOLE 1.25MM X 1.75MM#2]  43.55 9.35 90 top
GND8  RECTANGLE SOLDER PADS WITH HOLE 1.5MM X 2.5MM  [RECTANGLE SOLDER PADS WITH HOLE 1.25MM X 1.75MM#2]  7.75 31.35 90 top
GND9  RECTANGLE SOLDER PADS WITH HOLE 1.5MM X 2.5MM  [RECTANGLE SOLDER PADS WITH HOLE 1.25MM X 1.75MM#3]  18 1.5 0 top
GND10  RECTANGLE SOLDER PADS WITH HOLE 1.5MM X 2.5MM  [RECTANGLE SOLDER PADS WITH HOLE 1.25MM X 1.75MM#2]  12 10.9 270 top
H1  HOLE_4M  [HOLE_4MM]  7.27 37.75 0 top
H2  HOLE_4M  [HOLE_4MM]  7.25 7.25 0 top
H3  HOLE_4M  [HOLE_4MM]  37.75 7.25 0 top
H4  HOLE_4M  [HOLE_4MM]  37.75 37.25 0 top
L1  10uH  [IND-SMD_L4.4-W4.2_PSPMAA0412]  27.88 7.53 270 top
L2  10uH  [IND-SMD_L4.4-W4.2_PSPMAA0412]  6.8 18.9 0 top
LED1  19-217/GHC-YR1S2/3T  [LED0603-R-RD]  34.25 36.05 270 top
LED2  19-213/Y2C-CQ2R2L/3T(CY)  [LED0603-RD-YELLOW]  21.6 8.05 90 top
LED3  19-213/Y2C-CQ2R2L/3T(CY)  [LED0603-RD-YELLOW]  23.45 8.05 90 top
LED4  19-213/Y2C-CQ2R2L/3T(CY)  [LED0603-RD-YELLOW]  19.8 8.05 90 top
M1  ROUND SOLDER PADS WITH HOLE 1.5MM X 2.5MM COPY  [ROUND SOLDER PADS WITH HOLE 1MM X 1.75MM#4]  25.21 42.3 0 top
M2  ROUND SOLDER PADS WITH HOLE 1.5MM X 2.5MM COPY  [ROUND SOLDER PADS WITH HOLE 1MM X 1.75MM#4]  27.11 42.3 0 top
M3  ROUND SOLDER PADS WITH HOLE 1.5MM X 2.5MM COPY  [ROUND SOLDER PADS WITH HOLE 1MM X 1.75MM#4]  29.02 42.3 0 top
M4  ROUND SOLDER PADS WITH HOLE 1.5MM X 2.5MM COPY  [ROUND SOLDER PADS WITH HOLE 1MM X 1.75MM#4]  30.93 42.3 0 top
P1  SM08B-SRSS-TB(LF)(SN)  [CONN-TH_SM08B-SRSS-TB-LF-SN]  27.6 38.2 180 top
Q3  AO3400A  [SOT-23-3_L2.9-W1.6-P1.90-LS2.8-BR#2]  41.7 15.1 180 top
R1  1kΩ  [R0603#2]  19.85 4.65 90 top
R2  ICM-20689  [QFN-24_L4.0-W4.0-P0.50-TL-EP2.6]  17.65 14.65 0 top
R3  1MΩ  [R0603#2]  31.43 12.93 90 top
R4  100kΩ  [R0402]  34.23 13.33 270 top
R5  10K  [R0402#2]  38.37 13.07 180 top
R6  10K  [R0402#2]  32.4 19.2 270 top
R7  3.92kΩ  [R1206]  2.66 28.69 180 top
R8  22Ω  [R0402]  33.75 26.85 180 top
R9  22Ω  [R0402]  33.75 29.65 180 top
R10  51kΩ  [R0402]  3.78 26.7 90 top
R11  10K  [R0402#2]  23.25 33.65 0 top
R12  20Ω  [R0603#2]  1.85 19.65 270 top
R13  5.1kΩ  [R0402]  35.43 25.7 90 top
R14  47Ω  [R0402#2]  21.6 5.3 90 top
R15  2K  [R0402#2]  19.3 21.3 0 top
R16  75Ω  [R0603]  35.2 39.7 225 top
R17  220Ω  [R0402#2]  23.4 5.3 90 top
R18  18K  [R0402#2]  25 34.4 90 top
R19  5.1kΩ  [R0402]  35.2 30.75 90 top
R20  2.2K  [R0402#2]  38.38 11.83 180 top
R21  2.2K  [R0402#2]  38.38 10.61 180 top
R22  20Ω  [R0603#2]  28.33 12.28 180 top
R24  51kΩ  [R0402]  36.18 11.08 0 top
R26  41.2kΩ  [R1206]  7.52 27.75 0 top
R27  100kΩ  [R0402]  1.85 24.5 0 top
R28  1MΩ  [R0603#2]  1.9 21.95 180 top
R29  41.2kΩ  [R1206]  35.45 15.64 180 top
R30  7.5kΩ  [R0402]  35.43 12.78 270 top
RX1  ROUND SOLDER PADS WITH HOLE 1.5MM X 2.5MM COPY  [ROUND SOLDER PADS WITH HOLE 1MM X 1.75MM]  7.6 15.6 270 top
RX2  ROUND SOLDER PADS WITH HOLE 1.5MM X 2.5MM COPY  [ROUND SOLDER PADS WITH HOLE 1MM X 1.75MM]  7.6 14 270 top
RX3  ROUND SOLDER PADS WITH HOLE 1.5MM X 2.5MM COPY  [ROUND SOLDER PADS WITH HOLE 1MM X 1.75MM#2]  12.9 1.55 0 top
RX5  ROUND SOLDER PADS WITH HOLE 1.5MM X 2.5MM COPY  [ROUND SOLDER PADS WITH HOLE 1MM X 1.75MM#4]  32.84 42.3 0 top
RX6  ROUND SOLDER PADS WITH HOLE 1.5MM X 2.5MM COPY  [ROUND SOLDER PADS WITH HOLE 1MM X 1.75MM]  1.5 6.45 90 top
SCL1  ROUND SOLDER PADS WITH HOLE 1.5MM X 2.5MM COPY  [ROUND SOLDER PADS WITH HOLE 1MM X 1.75MM]  43.6 7.5 90 top
SDA1  ROUND SOLDER PADS WITH HOLE 1.5MM X 2.5MM COPY  [ROUND SOLDER PADS WITH HOLE 1MM X 1.75MM]  43.6 5.75 90 top
SW1  B3U-1000P  [KEY-SMD_B3U-1000PM]  19.85 36.75 90 top
TX1  ROUND SOLDER PADS WITH HOLE 1.5MM X 2.5MM COPY  [ROUND SOLDER PADS WITH HOLE 1MM X 1.75MM]  43.65 36.9 90 top
TX2  ROUND SOLDER PADS WITH HOLE 1.5MM X 2.5MM COPY  [ROUND SOLDER PADS WITH HOLE 1MM X 1.75MM]  7.6 12.4 270 top
TX2A  ROUND SOLDER PADS WITH HOLE 1.5MM X 2.5MM COPY  [ROUND SOLDER PADS WITH HOLE 1MM X 1.75MM]  7.8 33 90 top
TX3  ROUND SOLDER PADS WITH HOLE 1.5MM X 2.5MM COPY  [ROUND SOLDER PADS WITH HOLE 1MM X 1.75MM#2]  10.05 1.55 0 top
TX5  ROUND SOLDER PADS WITH HOLE 1.5MM X 2.5MM COPY  [ROUND SOLDER PADS WITH HOLE 1MM X 1.75MM]  43.65 34.9 270 top
TX6  ROUND SOLDER PADS WITH HOLE 1.5MM X 2.5MM COPY  [ROUND SOLDER PADS WITH HOLE 1MM X 1.75MM]  1.5 4.7 270 top
U1  NO  [QFN-8_L3.0-W3.0-P0.65-BL]  5.5 23 90 top
U2  STM32F722RET6  [LQFP-64_L10.0-W10.0-P0.50-LS12.0-BL]  25.53 25.95 270 top
U3  NO  [QFN-8_L3.0-W3.0-P0.65-BL]  32.23 9.18 0 top
U4  W25Q128JVSIQ  [SOIC-8_L5.3-W5.3-P1.27-LS8.0-BL]  37.9 20.05 90 top
U5  SM03B-SRSS-TB(LF)(SN)(P)  [CONN-SMD_SM03B-SRSS-TB-LF-SN-P]  14.15 40.15 180 top
U9  RT9013-33GB  [SOT-23-5_L3.0-W1.7-P0.95-LS2.8-BR]  24.95 14.25 0 top
U10  SM06B-SRSS-TB(LF)(SN)  [CONN-SMD_SM06B-SRSS-TB(LF)(SN)]  3.3 12.7 270 top
USB1  TYPE-C 16PIN 2MD(073)  [USB-C-SMD_TYPE-C-6PIN-2MD-073]  39.75 28.24 90 top
VBAT1  ROUND SOLDER PADS WITH HOLE 1.5MM X 2.5MM COPY  [ROUND SOLDER PADS WITH HOLE 1MM X 1.75MM#4]  23.3 42.3 0 top
VTX1  ROUND SOLDER PADS WITH HOLE 1.5MM X 2.5MM COPY  [ROUND SOLDER PADS WITH HOLE 1MM X 1.75MM#3]  7.75 34.55 90 top
X1  8MHz  [OSC-SMD_3P-L3.2-W1.3-P1.20-L]  16.05 27.45 90 top

## Footprints (pads in the part's own frame, mm; a bottom-side part is the same pattern mirrored in y, then rotated)
C0402
  rect 0.5x0.8 smd: 1(-0.5,0) 2(0.5,0)
C0402#2
  rect 0.79x0.54 smd: 1(-0.545,0) 2(0.545,0)
C0603
  rect 0.8x0.9 smd: 1(-0.7,0) 2(0.7,0)
C1206
  rect 1.2x1.9 smd: 1(-1.6,0) 2(1.6,0)
C1206#2
  rect 1.485x1.728 smd: 1(-1.593,0) 2(1.593,0)
CONN-SMD_4P-P1.00_SM04B-SRSS-TB-LF-SN
  rect 0.6x1.55 smd: 1(-1.5,1.938) 2(-0.5,1.938) 3(0.5,1.938) 4(1.5,1.938)
  rect 1.2x1.8 smd: 5(2.8,-1.938) 6(-2.8,-1.938)
CONN-SMD_SM03B-SRSS-TB-LF-SN-P
  rect 0.6x1.55 smd: 1(-1,1.938) 2(0,1.938) 3(1,1.938)
  rect 1.5x2 smd: 4(2.3,-1.938) 5(-2.3,-1.938)
CONN-SMD_SM06B-SRSS-TB(LF)(SN)
  rect 0.6x1.55 smd: 1(-2.5,1.938) 2(-1.5,1.938) 3(-0.5,1.938) 4(0.5,1.938) 5(1.5,1.938) 6(2.5,1.938)
  rect 1.5x2 smd: 7(3.8,-1.938) 8(-3.8,-1.938)
CONN-TH_SM08B-SRSS-TB-LF-SN
  rect 0.6x1.55 smd: 1(-3.5,1.937) 2(-2.502,1.938) 3(-1.502,1.938) 4(-0.502,1.938) 5(0.5,1.937) 6(1.498,1.938) 7(2.498,1.938) 8(3.5,1.937)
  rect 1.5x2 smd: 9(4.8,-1.938) 10(-4.8,-1.938)
HOLE_4MM
  round 4.5 hole 4: 1(0,0)
IND-SMD_L4.4-W4.2_PSPMAA0412
  rect 1.5x2.5 smd: 1(-1.85,0) 2(1.85,0)
KEY-SMD_B3U-1000PM
  rect 0.8x1.7 smd: 1(-1.7,0) 2(1.7,0)
LED0603-R-RD
  rect 0.8x0.8 smd: 1(0.851,0) 2(-0.851,0)
LED0603-RD-YELLOW
  rect 0.8x0.8 smd: 1(-0.799,-0.004) 2(0.799,0.004)
LQFP-64_L10.0-W10.0-P0.50-LS12.0-BL
  rect 0.3x2 smd: 1(-3.75,-5.75) 2(-3.25,-5.75) 3(-2.75,-5.75) 4(-2.25,-5.75) 5(-1.75,-5.75) 6(-1.25,-5.75) 7(-0.75,-5.75) 8(-0.25,-5.75) 9(0.25,-5.75) 10(0.75,-5.75) 11(1.25,-5.75) 12(1.75,-5.75) 13(2.25,-5.75) 14(2.75,-5.75) 15(3.25,-5.75) 16(3.75,-5.75) 33(3.75,5.75) 34(3.25,5.75) 35(2.75,5.75) 36(2.25,5.75) 37(1.75,5.75) 38(1.25,5.75) 39(0.75,5.75) 40(0.25,5.75) 41(-0.25,5.75) 42(-0.75,5.75) 43(-1.25,5.75) 44(-1.75,5.75) 45(-2.25,5.75) 46(-2.75,5.75) 47(-3.25,5.75) 48(-3.75,5.75)
  rect 2x0.3 smd: 17(5.75,-3.75) 18(5.75,-3.25) 19(5.75,-2.75) 20(5.75,-2.25) 21(5.75,-1.75) 22(5.75,-1.25) 23(5.75,-0.75) 24(5.75,-0.25) 25(5.75,0.25) 26(5.75,0.75) 27(5.75,1.25) 28(5.75,1.75) 29(5.75,2.25) 30(5.75,2.75) 31(5.75,3.25) 32(5.75,3.75) 49(-5.75,3.75) 50(-5.75,3.25) 51(-5.75,2.75) 52(-5.75,2.25) 53(-5.75,1.75) 54(-5.75,1.25) 55(-5.75,0.75) 56(-5.75,0.25) 57(-5.75,-0.25) 58(-5.75,-0.75) 59(-5.75,-1.25) 60(-5.75,-1.75) 61(-5.75,-2.25) 62(-5.75,-2.75) 63(-5.75,-3.25) 64(-5.75,-3.75)
OSC-SMD_3P-L3.2-W1.3-P1.20-L
  rect 0.6x1.4 smd: 1(-1.199,0) 2(0,0) 3(1.199,0)
QFN-8_L3.0-W3.0-P0.65-BL
  rect 0.33x1.5 smd: 1(0.975,1.25) 2(0.325,1.25) 3(-0.325,1.25) 4(-0.975,1.25) 5(-0.975,-1.25) 6(-0.325,-1.25) 7(0.325,-1.25) 8(0.975,-1.25)
QFN-24_L4.0-W4.0-P0.50-TL-EP2.6
  rect 0.8x0.28 smd: 1(-2,1.25) 2(-2,0.75) 3(-2,0.249) 4(-2,-0.25) 5(-2,-0.75) 6(-2,-1.25) 13(2.001,-1.25) 14(2.001,-0.75) 15(2.001,-0.25) 16(2.001,0.249) 17(2.001,0.75) 18(2.001,1.242)
  rect 0.28x0.8 smd: 7(-1.25,-2.001) 8(-0.75,-2.001) 9(-0.25,-2.001) 10(0.25,-2.001) 11(0.75,-2.001) 12(1.25,-2.001) 19(1.25,2) 20(0.75,2) 21(0.25,2) 22(-0.25,2) 23(-0.75,2) 24(-1.25,2)
  rect 2.7x2.7 smd: 25(0,-0.013)
R0402
  rect 0.566x0.54 smd: 1(-0.433,0) 2(0.433,0)
R0402#2
  rect 0.5x0.8 smd: 1(-0.5,0) 2(0.5,0)
R0603
  rect 0.8x0.9 smd: 1(-0.7,0) 2(0.7,0)
R0603#2
  rect 0.806x0.864 smd: 1(-0.753,0) 2(0.753,0)
R1206
  rect 1.208x1.701 smd: 1(-1.479,0) 2(1.478,0)
RECTANGLE SOLDER PADS WITH HOLE 1.25MM X 1.75MM
  rect 1x1 hole 0.61: 1(0,0)
RECTANGLE SOLDER PADS WITH HOLE 1.25MM X 1.75MM#2
  rect 1x1.75 hole 0.6: 1(0,0)
RECTANGLE SOLDER PADS WITH HOLE 1.25MM X 1.75MM#3
  rect 1.75x1.75 hole 0.6: 1(0.001,0)
ROUND SOLDER PADS WITH HOLE 1MM X 1.75MM
  oval 1x1.75 hole 0.6: 1(0,0)
ROUND SOLDER PADS WITH HOLE 1MM X 1.75MM#2
  rect 1.75x1.75 hole 0.6: 1(0,0)
ROUND SOLDER PADS WITH HOLE 1MM X 1.75MM#3
  rect 1x1.75 smd: 1(0,0)
ROUND SOLDER PADS WITH HOLE 1MM X 1.75MM#4
  rect 1x1 hole 0.61: 1(0,0)
SOIC-8_L5.3-W5.3-P1.27-LS8.0-BL
  oval 0.65x1.7 smd: 1(-1.905,-3.7) 2(-0.635,-3.7) 3(0.635,-3.7) 4(1.905,-3.7) 5(1.905,3.7) 6(0.635,3.7) 7(-0.635,3.7) 8(-1.905,3.7)
SOT-23-3_L2.9-W1.6-P1.90-LS2.8-BR
  rect 1.07x0.6 smd: 1(1.235,-0.95) 2(1.235,0.95) 3(-1.235,0)
SOT-23-3_L2.9-W1.6-P1.90-LS2.8-BR#2
  rect 1.25x0.7 smd: 1(1.25,-0.95) 2(1.25,0.95) 3(-1.25,0)
SOT-23-5_L3.0-W1.7-P0.95-LS2.8-BR
  rect 1.1x0.6 smd: 1(1.3,-0.95) 2(1.3,0) 3(1.3,0.95) 4(-1.3,0.95) 5(-1.3,-0.95)
SOT-666-6_L1.6-W1.2-P0.50-LS1.6-BR
  rect 0.85x0.3 smd: 1(0.725,-0.5) 2(0.725,0) 3(0.725,0.5) 4(-0.725,0.5) 5(-0.725,0) 6(-0.725,-0.5)
USB-C-SMD_TYPE-C-6PIN-2MD-073
  rect 0.6x1.1 smd: 1(-3.2,2.375) 2(-2.4,2.375) 11(2.4,2.375) 12(3.2,2.375)
  rect 0.3x1.1 smd: 3(-1.75,2.375) 4(-1.25,2.375) 5(-0.75,2.375) 6(-0.25,2.375) 7(0.25,2.375) 8(0.75,2.375) 9(1.25,2.375) 10(1.75,2.375)
  oval 1.2x2 hole 0.6x1.5: 13(-4.325,1.825) 14(4.325,1.825)
  oval 1.2x1.8 hole 0.6x1.2: 13(-4.325,-2.375) 14(4.325,-2.375)

## Nets
As in the schematic.

Pads without a net: H1 1; H2 1; H3 1; H4 1; R2 1 2 3 4 5 6 7 14 15 16 17 19 20 21; U2 2 3 7 8 10 24 26 27 33 39 40 49 50 53 54 57 61 62; U9 4; USB1 3 9 13 14

## Via types
v1: diameter 0.62, hole 0.31, Top Layer to Bottom Layer, 48 vias
v2: diameter 0.56, hole 0.31, Top Layer to Bottom Layer, 80 vias
v3: diameter 1, hole 0.5, Top Layer to Bottom Layer, 1 via
v4: diameter 1, hole 0.6, Top Layer to Bottom Layer, 7 vias

## Routing (per net, layer and track width the routed paths; a pad name or vN(x,y) marks a point on that pad's centre or on a via; arc(x,y) is an arc through that point)
+3.3V: length 23.6
  Top Layer w0.254: C19.2 22.6,18.8 22.65,18.85 22.75,19 22.78,20.21 ; v2(23.5,21.85) 23.25,21.85 22.78,21.38 U2.19 ; R5.2 37.87,11.84 R20.2 R21.2 ; U4.8 32.95,18.14 R6.2 ; 16.9,12.65 16.9,12.03 C23.2 ; v2(22.61,23.88) 22.43,23.7 U2.13 19.73,23.75 C32.2 ; 32.4,18.8 32.19,18.8 C37.2
  Top Layer w0.5: C23.2 16.24,11.4 v2(15.3,11.4) ; U9.5 23.65,11.45 21.6,9.4 21.6,8.75
  vias: v2(21.2,31.8) v2(21.6,33.5) v2(23.5,14.1) v2(29.9,21) v2(30.3,31.8)
+5V: length 18.2
  Top Layer w0.254: C4.2 U9.3
  Top Layer w0.5: 5.75,30.33 5.75,31.17 CN1.4 ; 30.55,17.35 30.55,15.1 30.55,17.35 ; 30.55,17.35 v1(30.15,17.75) ; 30.55,17.35 v1(30.95,17.75) ; U9.3 25.5,15.2 24.9,14.6 v2(24.9,14.2) 24.9,13.8 25.4,13.3 U9.1 26.25,11.65 LED3.2
  vias: v1(29.35,17.75) v1(31.75,17.75) v3(30.55,15.3)
+5VBAT: length 18.9
  Top Layer w0.5: R29.2 33.03,14.7 v1(32.35,14.7)
  Bottom Layer w0.5: v1(27.14,4.14) 25.73,4.14 25.73,11.61 28.82,14.25 32.35,14.25 v1(32.35,14.7)
  vias: v1(27.13,3.09) v1(27.12,1.93) v1(27.12,0.8) v1(28.7,16.3)
+5VBUS: length 3.1
  Top Layer w0.254: v2(33.02,27.98) 33.29,28.25 33.93,28.25 ; v2(36.32,25.82) 37.36,25.82 USB1.2 ; USB1.11 v2(36.32,30.64)
  vias: v2(32.45,16.25)
+9V: length 11.3
  Top Layer w0.254: 9V2.1 13.15,36.75 U5.3
  Top Layer w0.5: 9V.1 6.95,10.2 U10.6 ; 9VTX.1 9.13,27.88 9,27.75 ; LED4.2 16.1,8.85 v2(16,8.75)
  vias: v1(10.1,17.75) v1(11.1,17.75) v1(12,17.75) v1(13.05,17.75) v1(13.95,17.75)
GND: length 20.2
  Top Layer w0.254: v2(35.15,29.47) 35.02,29.47 34.6,29.05 34.6,28.25 ; R2.11 18.4,13.88 R2.25 18.91,15.89 20.11,15.89 21.05,14.96 ; 21.7,18.25 21.7,18.55 22.28,19.13 22.28,20.2 ; U2.47 30,29.2 29.8,29.4 v2(28.85,29.4) ; v2(18.26,24.67) 18.7,24.2 U2.12 ; 22.28,31.7 22.29,30.2 ; v2(22.25,21.75) 22.25,20.23 U2.18 ; D1.2 34.6,28.25 ; v2(29.3,21.9) 28.78,21.38 U2.31
  vias: v1(0.5,23.25) v1(0.8,18.8) v1(9.45,20.95) v1(10.56,20.95) v1(11.68,20.95) v1(12.79,20.95) v1(13.9,20.95) v1(29.35,13.3) v1(30.13,4.95) v1(30.15,3.93) v1(30.17,2.93) v1(30.15,1.95) v1(30.16,0.9) v1(34.25,9.15) v1(35.4,14.3) v2(3.58,32.17) v2(16.85,21.85) v2(17.28,10.54) v2(19.72,11.6) v2(19.85,16.69) v2(21.66,35.94) v2(22.29,30.2) v2(22.55,24.7) v2(23.2,25.7) v2(23.56,28.66) v2(24.43,29.34) v2(26,22.65) v2(26.8,23.25) v2(27.5,26.7) v2(28.14,27.56) v2(29.35,15.1) v2(31.15,38.7) v2(34.32,25.64) v2(35.01,24.24) v2(38.81,18.77) v2(42.95,16.05) v4(2.1,40.4) v4(2.4,2.7) v4(3.85,42.75) v4(37.35,41.7) v4(41.35,42.7) v4(42.1,2.7) v4(42.9,40.35)
+VLIPO: length 22.6
  Top Layer w0.254: 25.1,36.01 25,35.91 R18.2 ; U3.7 v1(32.56,9.18) ; v2(23.95,38) 23.95,41.65 VBAT1.1
  Top Layer w0.5: v1(30.15,13.25) 30.59,13.69 R3.2 ; 6.75,23.33 5.55,23.35 ; 0.6,20.65 0.6,21.95 R28.2
  Bottom Layer w0.5: v1(5.55,23.35) 3.3,23.35 v1(0.6,20.65) ; v1(32.56,9.18) 30.15,11.59 v1(30.15,13.25)
  vias: v1(9.5,24.2) v1(10.61,24.2) v1(11.72,24.2) v1(12.84,24.2) v1(13.95,24.2) v1(33.27,4.68) v1(33.27,3.76) v1(33.27,2.84) v1(33.27,1.92) v1(33.27,1) v2(23.1,38) v2(24.8,38)
ADC_CURR: length 25.4
  Top Layer w0.254: v2(22.4,25.7) 19.78,25.7 ; 34.74,42.3 34.74,41.14 33.55,39.95 33.55,38.6 33.25,38.3 32.1,38.3 31.1,37.3 31.1,34.19 v2(30.5,34.19)
  Bottom Layer w0.254: 30.5,34.19 30.5,33.8 v2(22.4,25.7)
ADC_VBAT: length 20.8
  Top Layer w0.254: U2.11 21.78,24.7 21.78,24.89 ; v2(20.8,21.1) 20,21.1 R15.2 ; R18.1 v2(25,33.15)
  Bottom Layer w0.254: v2(20.8,21.1) 21.78,22.08 v2(21.78,24.89) ; 25,33.15 27.1,33.15 27.1,31.2 21.78,25.88 21.78,24.89
BEEPER: length 29.3
  Top Layer w0.254: U2.4 22.15,28.2 24.85,25.6 v2(29.45,25.6)
  Top Layer w0.5: Q3.1 40.5,16.05 v2(41.55,15)
  Bottom Layer w0.254: v2(41.55,15) 39.05,15 30.3,23.75 30.3,24.75 v2(29.45,25.6)
BOOT0: length 8.6
  Top Layer w0.254: R11.2 23.78,33.62 U2.60 ; 23.75,33.65 23.75,34.93 20.23,38.45 SW1.2
CS_FLASH: length 15.9
  Top Layer w0.254: v2(39.24,18.2) 39.3,18.14 U4.1 ; U2.41 32.64,26.2 v2(32.89,25.95)
  Bottom Layer w0.254: v2(32.89,25.95) 32.89,22.14 36.85,18.2 v2(39.24,18.2)
CS_GYRO: length 10.3
  Top Layer w0.254: U2.20 23.25,20.2 23.25,16.7 21.45,16.7 20.8,17.35 17.45,17.35 17.4,17.3 R2.22
I2C_SCL: length 34.5
  Top Layer w0.254: U2.28 27.28,22.23 28.65,23.6 v2(29.35,23.6) ; R20.1 39.58,11.83 39.69,11.84 39.7,10.9 43.1,7.5 SCL1.1
  Bottom Layer w0.254: v2(29.35,23.6) 39.3,13.65 39.3,10.55 42.35,7.5 SCL1.1
I2C_SDA: length 34.6
  Top Layer w0.254: SDA1.1 38.8,10.55 38.8,10.95 ; R21.1 38.88,10.92 38.8,11 ; U2.29 27.78,22.03 28.5,22.75 v2(29.3,22.75)
  Bottom Layer w0.254: SDA1.1 42.95,5.75 38.15,10.55 38.15,13.9 v2(29.3,22.75)
INT_GYRO: length 15.5
  Top Layer w0.254: U2.25 25.78,18.02 v2(26.31,17.49) ; 18.9,12.65 18.9,11.62 v2(18.92,11.6)
  Bottom Layer w0.254: v2(18.92,11.6) 20,12.68 20,14.99 21.36,16.34 25.71,16.34 26.31,16.94 v2(26.31,17.49)
LED0: length 10.3
  Top Layer w0.254: U2.46 v2(29.45,28.7) ; v2(34.25,34.05) LED1.1
  Bottom Layer w0.254: 29.45,28.7 34.25,33.5 v2(34.25,34.05)
MOTOR1: length 11.1
  Top Layer w0.254: U2.56 25.75,34.4 25.75,34.45 26.1,34.85 26.1,39.05 25.21,39.94 M1.1
MOTOR2: length 10.9
  Top Layer w0.254: M2.1 27.1,36.01 27.05,34.8 26.3,34 U2.55
MOTOR3: length 34.5
  Top Layer w0.254: v2(26.45,24.7) 31.28,24.7 ; v2(27.55,34.1) 27.55,34.5 28.1,35.05 P1.4 28.1,39.2 29.02,40.12 M3.1
  Bottom Layer w0.254: 27.55,34.1 27.8,34.35 27.8,35.85 27.9,35.95 32.1,35.95 32.75,35.3 32.75,33.3 29.55,30.1 28.7,30.1 26.45,27.85 v2(26.45,24.7)
MOTOR4: length 31.6
  Top Layer w0.254: M4.1 29.85,41.22 29.85,41.15 29.65,40.95 29.65,39.5 29.1,38.95 P1.3 29.1,35 v2(28.75,34.65) ; v2(27.2,23.85) 27.55,24.2 U2.37
  Bottom Layer w0.254: v2(27.2,23.85) 25.9,23.85 25.55,24.2 25.55,27.9 31.85,34.2 31.85,35.25 30.15,35.25 29.55,34.65 v2(28.75,34.65)
PIN_B-: length 3.7
  Top Layer w0.5: 43.55,12.75 42.15,14.15 Q3.2
SPI1_SCK: length 10.5
  Top Layer w0.254: v2(23.96,18.19) 23.78,18.37 U2.21 ; v2(20.25,18.2) 20.25,17.8 17.25,17.8 16.9,17.45 R2.23
  Bottom Layer w0.254: v2(20.25,18.2) 20.26,18.19 v2(23.96,18.19)
SPI1_SDI: length 12.9
  Top Layer w0.254: v2(15.65,16.79) 16.26,16.79 R2.24 ; U2.23 24.78,17.61 v2(24.71,17.54)
  Bottom Layer w0.254: v2(15.65,16.79) 15.7,16.79 16.45,17.54 v2(24.71,17.54)
SPI1_SDO: length 21.5
  Top Layer w0.254: R2.9 17.4,11.64 v2(17.3,11.54) ; v2(25.56,21.89) 24.86,22.59 v2(24.16,22.59) 24.28,22.47 U2.22
  Bottom Layer w0.254: v2(17.3,11.54) 19.21,13.44 19.21,15.09 21.06,16.94 25.21,16.94 25.56,17.29 v2(25.56,21.89)
SPI2_SCK: length 4.8
  Top Layer w0.254: U4.6 32.75,20.68 32.75,22.41 32.46,22.7 31.28,22.7
SPI2_SDI: length 5.6
  Top Layer w0.254: U4.5 34.2,22.33 34.96,23.09 34.96,23.35 34.54,23.77 31.4,23.77 31.33,23.7 U2.36
SPI2_SDO: length 11.9
  Top Layer w0.254: v2(33.66,23.19) 31.28,23.19 U2.35 ; U4.2 41.17,19.84 v2(39.76,19.84)
  Bottom Layer w0.254: v2(39.76,19.84) 36.41,23.19 v2(33.66,23.19)
UART1_RX: length 47.8
  Top Layer w0.254: U10.1 7.2,15.2 RX1.1 ; 24.28,31.7 24.28,30.58 23.55,29.85 23.55,29.45
  Bottom Layer w0.254: RX1.1 7.6,25.9 5.6,27.9 5.6,34.2 6,34.6 23.55,34.6 23.55,29.45
  vias: v2(23.55,29.45)
UART1_TX: length 32.6
  Top Layer w0.254: v2(24.8,29.95) 24.78,31.7
  Bottom Layer w0.254: TX1.1 42.2,36.9 38.4,40.7 26.3,40.7 26.3,36.1 24.1,33.9 24.1,30.65 v2(24.8,29.95)
UART2_RX: length 22.7
  Top Layer w0.254: RX2.1 7.1,14 6.35,13.25 5.49,13.25 5.49,13 ; 14.76,20.2 21.84,20.2
  Bottom Layer w0.254: v2(14.7,20.2) 14.7,18.8 9.2,18.7 9.2,14.4 8.8,14 RX2.1
UART2_TX: length 43.3
  Top Layer w0.254: 5.49,12 5.49,12.25 7.45,12.25 TX2.1 ; U2.16 18,22.2 v2(17.65,21.85) ; 5.09,33.83 5.93,33.83 6.76,33 TX2A.1
  Bottom Layer w0.254: TX2.1 9.51,12.4 17.65,20.54 v2(17.65,21.85) 17.65,32.6 17.25,33 TX2A.1
UART3_RX: length 14.3
  Top Layer w0.254: P1.2 30.1,35.15 29.65,34.7 29.65,33.85 28.7,33.85 27.78,32.95 27.78,31.7 ; 32.83,42.3 32.83,42.09 32.2,41.45 30.8,41.45 30.8,39.6 30.1,38.9 30.1,36.01
UART3_TX: length 17.6
  Top Layer w0.254: TX5.1 43.65,34.55 36.6,34.55 35.35,33.3 28.75,33.3 28.28,32.83 28.28,31.7
UART4_RX: length 35.5
  Top Layer w0.254: U2.15 22.8,22.7 v2(22.9,22.6)
  Bottom Layer w0.254: v2(22.9,22.6) 22.9,20.5 18.46,20.5 14.05,16.24 9.5,11.54 9.5,9.99 1.5,10 RX6.1
UART4_TX: length 43.6
  Top Layer w0.254: v2(25.4,23.2) 19.81,23.2 19.79,23.22 ; TX6.1 8.95,4.7 14.6,10.35 14.6,17.45 16.05,18.9 18.5,18.9 v2(18.55,18.95)
  Bottom Layer w0.254: v2(25.4,23.2) 24.8,23.2 24.8,19.4 24.35,18.95 v2(18.55,18.95)
UART5_RX: length 37.6
  Top Layer w0.254: v2(29.02,27.54) 29.02,27.2 31.28,27.2
  Bottom Layer w0.254: 12.9,1.55 12.9,2.25 17.5,6.85 17.5,7.65 21.25,11.4 21.25,14.55 22.05,15.35 26.1,15.35 28.69,17.94 28.69,25.94 29.02,26.27 v2(29.02,27.54)
UART5_TX: length 40.2
  Top Layer w0.254: v2(28.3,26.7) 31.28,26.7
  Bottom Layer w0.254: v2(28.3,26.7) 28.17,26.7 28.17,18.1 25.92,15.85 21.6,15.85 20.65,14.9 20.65,11.7 16.75,7.8 16.75,6.9 13.25,3.45 10.05,3.45 10.05,1.55
USB_CON_D+: length 6
  Top Layer w0.254: USB1.8 38.8,28.99 38.8,27.98 37.38,27.98 ; 37.08,29.01 35.71,29.01 35.47,28.77 35.07,28.77
USB_CON_D-: length 4.2
  Top Layer w0.254: 36.05,27.75 36.05,28.48 37.38,28.48 ; USB1.5 36.24,27.49 36.05,27.75 35.38,27.75
USB_D+: length 2.9
  Top Layer w0.254: R9.2 33.32,29.17 32.35,28.2 U2.45
USB_D-: length 2.4
  Top Layer w0.254: 31.28,27.7 32.49,27.7 33.35,26.84
VIDEO: length 15.6
  Top Layer w0.5: CN1.1 7.75,34.83 VTX1.1 15.95,34.55 15.95,38.21 15.15,38.21
$1N9: length 10.7
  Top Layer w0.254: U4.3 39.18,20.68 38.21,19.71 38.21,17.77 38.87,17.11 R5.1
$1N10: length 2
  Top Layer w0.254: 32.4,19.8 32.79,19.42 34.2,19.42
$1N26: length 1.9
  Top Layer w0.5: R1.2 19.85,7.2 LED4.1
$1N27: length 1.5
  Top Layer w0.5: LED3.1 23.45,5.85 R17.2
$1N39: length 2.5
  Top Layer w0.5: LED1.2 34.25,38.75 34.71,39.2
$1N43: length 1.2
  Top Layer w0.5: 21.6,7.05 R14.2
$1N92: length 4.1
  Top Layer w0.254: U2.6 18.31,27.2 17.36,26.25 X1.1
$1N93: length 4.1
  Top Layer w0.254: X1.3 17.41,28.64 18.35,27.7 U2.5
$1N96: length 2.4
  Top Layer w0.254: C20.2 28.28,19.08 U2.30
$1N110: length 1
  Top Layer w0.254: 33.93,27.75 34.22,27.46 34.22,26.84
$1N111: length 1
  Top Layer w0.254: R9.1 34.18,29.01 33.93,28.75
$1N118: length 2.8
  Top Layer w0.254: C2.2 17.9,10.5 17.9,12.65
$1N127: length 2.3
  Top Layer w0.254: USB1.10 35.53,29.99 35.2,30.32
$1N128: length 2.3
  Top Layer w0.254: USB1.4 36.29,26.99 R13.2
$1N143: length 1.9
  Top Layer w0.254: R3.1 31.93,11.68 31.93,10.44
$1N144: length 5.4
  Top Layer w0.254: 33.23,7.94 33.23,8.96 v1(33.46,9.18) ; 34.23,12.9 34.28,12.85 v1(34.28,11.88)
  Bottom Layer w0.254: 33.46,9.18 33.46,9.36 34.28,10.18 34.28,11.88
$1N145: length 4.3
  Top Layer w0.254: U3.2 32.55,12.51 C9.2 33.13,12.83 34.06,13.76 R4.1
$1N146: length 3.3
  Top Layer w0.254: R22.1 29.36,12.28 30.26,11.38 30.26,10.83 30.65,10.44 31.28,10.44
$1N147: length 1.4
  Top Layer w0.254: C13.2 27.48,11.08 27.58,11.18 R22.2
$1N151: length 5.9
  Top Layer w0.254: 36.68,12.35 R30.2
  Top Layer w0.5: R24.2 36.61,15.32 R29.1
$1N153: length 2.9
  Top Layer w0.254: 33.23,10.44 33.92,11.13 35.82,11.13
$1N154: length 2.4
  Top Layer w0.254: 4.15,23.99 3.78,24.36 R10.1
$1N156: length 4.2
  Top Layer w0.254: R7.1 3.78,28.33 3.78,27.13 5.42,27.13 R26.1
$1N159: length 1.6
  Top Layer w0.254: R12.2 2.1,18.65 C18.2
$1N160: length 3.5
  Top Layer w0.254: R12.1 1.85,20.6 3.45,20.6 4.15,21.3 4.15,22.04
$1N162: length 3.7
  Top Layer w0.254: C21.2 2.43,23.33 4.25,23.33 ; 2.35,23.01 2.35,23.3 1.41,24.24 1.41,24.41
$1N163: length 6.6
  Top Layer w0.254: 6.65,23.99 5.66,23.99 5.4,24.25 v1(5.4,25.4) ; 2.28,24.41 v1(2.3,25.4)
  Bottom Layer w0.254: v1(5.4,25.4) v1(2.3,25.4)
$1N164: length 1.9
  Top Layer w0.254: U1.3 3.38,22.67 R28.1

## Copper pours and planes (outline as drawn; the poured copper is in the pictures)
+3.3V on Top Layer: 18.9,35.55 20.85,35.55 22,34.4 22,30.6 20.85,29.45 20.4,29.45 20.35,29.5 18.7,29.5 18.7,30.2 18.85,30.35 19.4,30.35 19.85,30.8 19.85,34.25 19.75,34.35 19.05,34.35 18.9,34.6
+3.3V on Top Layer: 29.7,29.5 32.45,29.5 32.45,30.95 32.4,31 31.1,31 30.85,31.25 30.85,32.35 30.7,32.5 29.7,32.5
+3.3V on Top Layer: 24.2,14.5 23,14.5 23,15.65 21.85,15.65 21.85,13.75 20.3,13.75 20.2,13.55 19.55,13.55 19.55,13.3 19.6,13.25 20.15,13.25 20.25,13.15 20.25,12.95 21.95,12.95 22.05,12.85 22.9,12.85 22.95,12.9 24.2,12.9
+3.3V on Top Layer: 38.23,13.28 38.23,17.09 37.81,17.08 37.8,18.47 33.1,18.47 33.1,17.2 36.66,17.2 36.66,15.55 37.34,15.53 37.36,13.28
+3.3V on Top Layer: 31.4,19.65 31.4,20 30.3,21.25 29.1,21.25 29.1,18.95 29.65,18.95 29.65,19.65
+3.3V on PWR1: 16.2,34 32.2,34 32.1,33.9 32.1,20.3 31.9,20.1 16.2,20.1
+3.3V on PWR2: 18.7,24.4 24.3,24.4 24.5,24.2 24.5,9.6 14.95,9.6 14.95,13.8 18.6,13.7
+5V on Top Layer: 8.95,29.05 5.85,29.05 5.15,29.75 4.2,29.75 4.2,30.5 4.35,30.65 8.95,30.65
+5V on Top Layer: 30.05,19.3 30.05,18.2 29.95,18.1 29.05,18.1 29,18.05 29,17.35 32.1,17.35 32.1,18.05 32.05,18.1 31.25,18.1 31.05,18.3 31.05,19.25 31,19.3
+5V on PWR1: 29.6,17.2 31.4,17.2 31.5,17.1 31.5,14.5 29.6,14.5
+5V on PWR1: 32.2,17.1 28.8,17.1 28.8,18.3 24.3,18.3 24.3,17 25.4,16.1 25.4,12.7 24.2,11.5 24.2,-1 14.6,-1 14.2,-0.6 3.3,-0.6 3.2,-0.5 3.2,6 3.9,6.7 20.3,6.7 20.3,17.9 14.9,17.9 14.9,28 14.1,28.8 6.3,28.8 5.7,29.4 5.7,30.1 6.2,30.6 14.9,30.6 16.4,29.1 16.4,20.2 16.6,20 32.2,20
+5V on PWR1: 31.2,15.65 31.15,15.7 30.1,15.7 30.1,14.65 38.05,14.65 38.5,14.2 38.45,7.65 35.95,7.6 35.9,-0.05 37,-0.05 40.25,-0.1 44.85,-0.15 44.8,13.9 44.85,18.7 41.55,18.7 41.55,17.25 38.6,17.3 38.6,15.6 38.1,15.8 31.7,15.85 31.7,15.65
+5VBAT on Top Layer: 29.7,16.95 28.3,16.95 28.3,15.45 29.7,15.45
+5VBAT on Top Layer: 29.2,6.6 26.5,6.6 26.3,6.4 26.3,4.9 26.2,4.8 24.6,4.8 24.5,4.7 24.5,0.1 24.6,0 27.8,0 27.9,0.1 27.9,4.7 28,4.8 29.3,4.8 29.3,6.5
+5VBAT on PWR1: 29.1,17.1 29.1,15.5 28,15.5 27.8,15.4 27.8,0.25 24.6,0.25 24.5,0.35 24.5,10.7 26.95,13.15 27,17.1
+5VBUS on Top Layer: 31.4,16.95 32.55,16.95 32.75,16.75 32.75,15.65 32.55,15.45 31.4,15.45
+5VBUS on PWR1: 38.2,31.9 35.8,31.9 35.75,28.6 32.5,28.6 32.5,26.8 32.77,26.58 34.54,26.58 34.93,26.2 34.93,25.7 35.1,25.5 35.05,16.93 34.93,16.81 32,16.8 32,16.15 32.9,16.2 32.9,16.5 36.05,16.5 36.07,15.92 37.72,17.57 37.72,24.81 37.85,24.93 38.2,25
+9V on Top Layer: 9.45,20.25 9.6,20.1 9.6,18.3 9.75,18.15 13.95,18.15 13.95,15.6 9.65,15.55 9.35,15.55 9.35,17.5 7.75,17.5 7.75,20.25
+9V on PWR1: 13,37 13,34.1 12.95,34.05 4.68,34.05 4.46,33.83 4.46,28.74 4.6,28.6 13.77,28.6 14.62,27.75 14.62,10.13 15,9.74 16.8,9.74 17.1,9.44 17.1,8.15 16.75,7.8 6.44,7.8 3.7,10.54 0.15,10.54 0.1,10.59 0.1,36.85 0.25,37
GND on Top Layer: -1.89,47.64 48.11,47.64 48.11,-2.36 47.11,-3.36 -1.89,-3.36
GND on Bottom Layer: -5.39,50.59 52.61,50.59 53.61,49.59 53.61,-6.41 52.61,-7.41 -6.39,-7.41
GND on GND: -2,47 48,47 48,-3 47,-4 -2,-4
GND on PWR1: -3,49 51,49 50,48 50,-7 49,-6 -5,-6
GND on PWR2: -5,50 53,50 54,49 54,-7 53,-8 -6,-8
GND on GND: -5.47,53.02 57.53,53.02 57.53,-10.98 56.53,-9.98 -5.47,-9.98
+VLIPO on Top Layer: 14.25,26.45 9.05,26.45 9.05,25.95 7.5,23.55 5.95,23.55 5.95,23.1 9.15,23.1 9.15,23.8 14.25,23.8
+VLIPO on Top Layer: 35.48,5.28 35.43,5.23 35.43,0.48 32.83,0.48 32.73,0.58 32.73,5.18 32.33,5.58 32.33,8.33 32.78,8.33 32.78,7.03 32.83,6.98 35.38,6.98 35.48,6.88
+VLIPO on Top Layer: 24.75,35.9 24.75,37.45 22.55,37.45 22.55,38.65 25.45,38.65 25.45,35.9
+VLIPO on PWR2: 14.5,39.5 32.5,39.5 32.3,10.3 35.7,6.9 35.7,-0.5 32.1,-0.5 32.1,8.4 30.2,10.3 27.5,10.3 26.5,11.3 26.5,24.7 25.4,25.8 17.2,25.8 14.6,23.2 6.2,23.2 6,23 4.9,23 4.8,23.1 4.8,23.7 5,23.9 7.3,23.9 8.5,25.1 8.5,26.3 9.4,27.2 14.4,27.2
$1N148 on Top Layer: 32.11,7.93 32.11,8.93 31.61,9.43 30.71,9.43 29.16,11.03 29.16,11.78 28.16,11.78 28.16,10.28 28.11,10.23 26.56,10.23 26.51,10.18 26.51,8.43 29.31,8.43 29.31,8.98 31.76,8.93 31.76,7.93
$1N158 on Top Layer: 6.3,22.85 5.45,22.85 5.3,22.75 5.3,21.3 4.6,20.8 3.8,20.25 2.75,20.25 2.75,19.2 4,19.2 4.1,19.15 4.1,17.6 4.5,17.6 5.9,17.65 5.9,20.45 5.6,20.75 5.6,22.3 5.7,22.5 6.3,22.5

## Text on the board
Bottom Silkscreen Layer: PLACA DE TESTE! | V1.3A 1124  ALPHA | USE ONLY SKYSTARS ESC | USE APENAS ESC SKYSTARS | This is a test board and should be treated as such
Top Silkscreen Layer: T4 | R4 | +5 | G | +9 | T2 | VID | R2 | T5 | R5 | B+ | B- | DA | T3 | CL | T1 | DJI | <
